# EAGLE design 17323^1 (EAGLE 7.6.0)
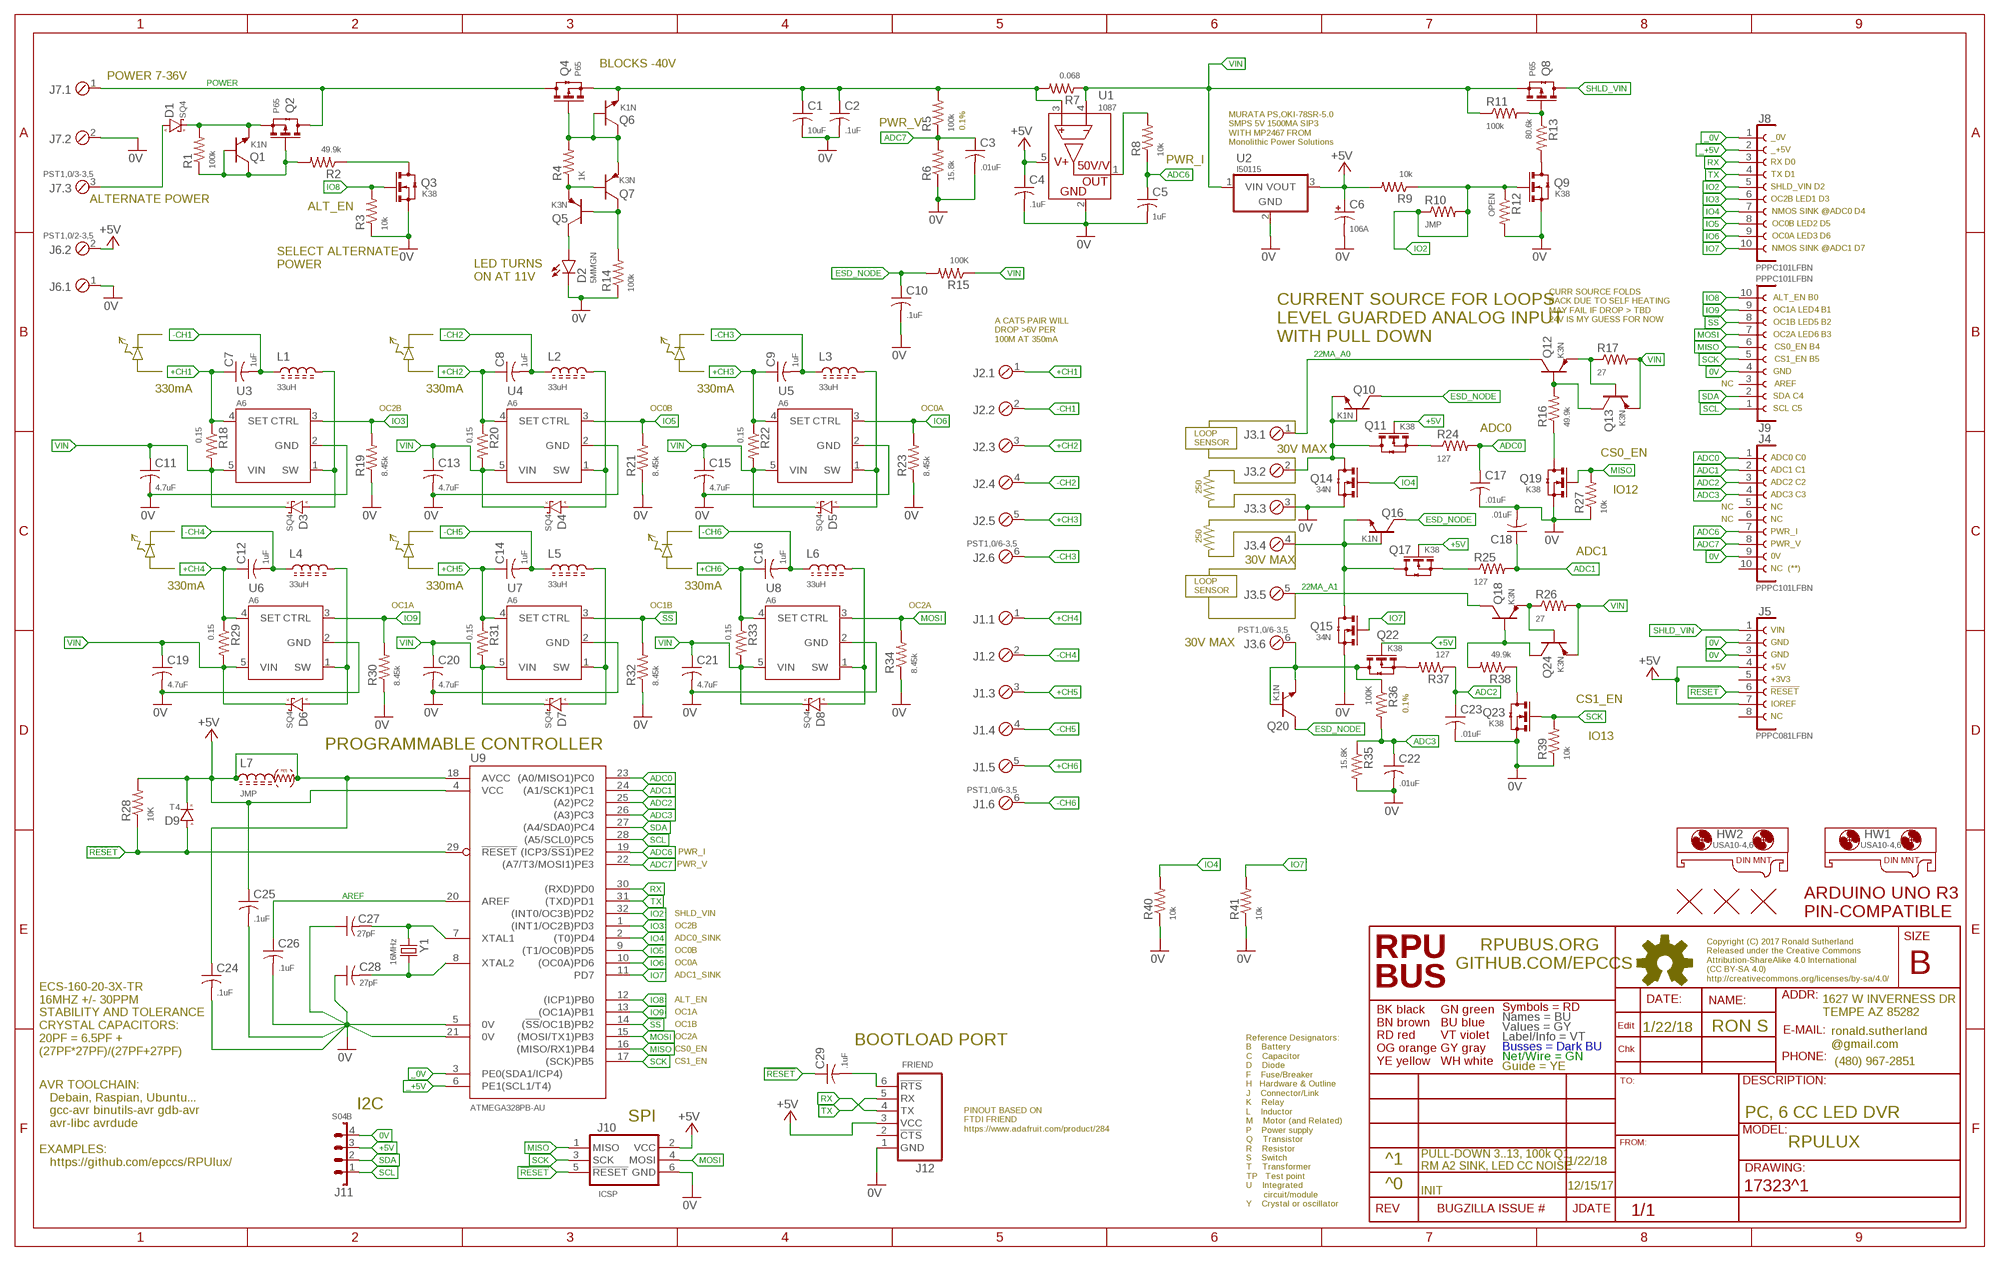
[diagram p0: schematic, sheet 1]

## Parts
C1  10uF  CC1206  [C1206(3216)]
C2  .1uF  CC0805A  [C0805(2012)]
C3  .01uF  CC0603A  [C0603(1608)]
C4  .1uF  CC0603A  [C0603(1608)]
C5  1uF  CC0805A  [C0805(2012)]
C6  106A  CT1206  [3216]
C7  1uF  CC0805A  [C0805(2012)]
C8  1uF  CC0805A  [C0805(2012)]
C9  1uF  CC0805A  [C0805(2012)]
C10  .1uF  CC0603A  [C0603(1608)]
C11  4.7uF  CC1206  [C1206(3216)]
C12  1uF  CC0805A  [C0805(2012)]
C13  4.7uF  CC1206  [C1206(3216)]
C14  1uF  CC0805A  [C0805(2012)]
C15  4.7uF  CC1206  [C1206(3216)]
C16  1uF  CC0805A  [C0805(2012)]
C17  .01uF  CC0603A  [C0603(1608)]
C18  .01uF  CC0603A  [C0603(1608)]
C19  4.7uF  CC1206  [C1206(3216)]
C20  4.7uF  CC1206  [C1206(3216)]
C21  4.7uF  CC1206  [C1206(3216)]
C22  .01uF  CC0603A  [C0603(1608)]
C23  .01uF  CC0603A  [C0603(1608)]
C24  .1uF  CC0603A  [C0603(1608)]
C25  .1uF  CC0603A  [C0603(1608)]
C26  .1uF  CC0603A  [C0603(1608)]
C27  27pF  CC0603A  [C0603(1608)]
C28  27pF  CC0603A  [C0603(1608)]
C29  .1uF  CC0603A  [C0603(1608)]
D1  SQ4  DSMA  [SMA]
D2  5MMGN  LED5MM  [LED5MM]
D3  SQ4  DSMA  [SMA]
D4  SQ4  DSMA  [SMA]
D5  SQ4  DSMA  [SMA]
D6  SQ4  DSMA  [SMA]
D7  SQ4  DSMA  [SMA]
D8  SQ4  DSMA  [SMA]
D9  T4  DSOD123  [SOD123]
HW1  USA10-4,6  MOUNT-HOLE5.0  [USA10]
HW2  USA10-4,6  MOUNT-HOLE5.0  [USA10]
J1  PST1,0/6-3,5  MCV6  [MCV6]
J2  PST1,0/6-3,5  MCV6  [MCV6]
J3  PST1,0/6-3,5  MCV6  [MCV6]
J4  PPPC101LFBN  F1X10  [F1X10]
J5  PPPC081LFBN  F1X8  [F1X8]
J6  PST1,0/2-3,5  MCV2  [MCV2]
J7  PST1,0/3-3,5  MCV3  [MCV3]
J8  PPPC101LFBN  F1X10  [F1X10]
J9  PPPC101LFBN  F1X10  [F1X10]
J10  ICSP  ISP-SPIPTH  [ISP]
J11  S04B  B04B  [B04B]
J12  FRIEND  [FRIEND]
L1  33uH  L2424  [L2424]
L2  33uH  L2424  [L2424]
L3  33uH  L2424  [L2424]
L4  33uH  L2424  [L2424]
L5  33uH  L2424  [L2424]
L6  33uH  L2424  [L2424]
L7  JMP  L0805  [C0805(2012)]
Q1  K1N  NPNSOT23  [SOT23]
Q2  P65  N-CHSOT23  [SOT23]
Q3  K38  N-CHSOT23  [SOT23]
Q4  P65  N-CHSOT23  [SOT23]
Q5  K3N  PNPSOT23  [SOT23]
Q6  K1N  NPNSOT23  [SOT23]
Q7  K3N  PNPSOT23  [SOT23]
Q8  P65  N-CHSOT23  [SOT23]
Q9  K38  N-CHSOT23  [SOT23]
Q10  K1N  NPNSOT23  [SOT23]
Q11  K38  N-CHSOT23  [SOT23]
Q12  K3N  PNPSOT23  [SOT23]
Q13  K3N  PNPSOT23  [SOT23]
Q14  34N  N-CHSOT23  [SOT23]
Q15  34N  N-CHSOT23  [SOT23]
Q16  K1N  NPNSOT23  [SOT23]
Q17  K38  N-CHSOT23  [SOT23]
Q18  K3N  PNPSOT23  [SOT23]
Q19  K38  N-CHSOT23  [SOT23]
Q20  K1N  NPNSOT23  [SOT23]
Q22  K38  N-CHSOT23  [SOT23]
Q23  K38  N-CHSOT23  [SOT23]
Q24  K3N  PNPSOT23  [SOT23]
R1  100k  R0805  [C0805(2012)]
R2  49.9k  R0805  [C0805(2012)]
R3  10k  R0805  [C0805(2012)]
R4  1K  R0805  [C0805(2012)]
R5  100k  R0805  [C0805(2012)]
R6  15.8k  R0805  [C0805(2012)]
R7  0.068  R1210  [C1210(3225)]
R8  10k  R0805  [C0805(2012)]
R9  10k  R0805  [C0805(2012)]
R10  JMP  R0805  [C0805(2012)]
R11  100k  R0805  [C0805(2012)]
R12  OPEN  R0805  [C0805(2012)]
R13  80.6k  R0805  [C0805(2012)]
R14  100k  R0805  [C0805(2012)]
R15  100K  R0805  [C0805(2012)]
R16  49.9k  R0805  [C0805(2012)]
R17  27  R0805  [C0805(2012)]
R18  0.15  R1210  [C1210(3225)]
R19  8.45k  R0805  [C0805(2012)]
R20  0.15  R1210  [C1210(3225)]
R21  8.45k  R0805  [C0805(2012)]
R22  0.15  R1210  [C1210(3225)]
R23  8.45k  R0805  [C0805(2012)]
R24  127  R0805  [C0805(2012)]
R25  127  R0805  [C0805(2012)]
R26  27  R0805  [C0805(2012)]
R27  10k  R0805  [C0805(2012)]
R28  10K  R0805  [C0805(2012)]
R29  0.15  R1210  [C1210(3225)]
R30  8.45k  R0805  [C0805(2012)]
R31  0.15  R1210  [C1210(3225)]
R32  8.45k  R0805  [C0805(2012)]
R33  0.15  R1210  [C1210(3225)]
R34  8.45k  R0805  [C0805(2012)]
R35  15.8K  R0805  [C0805(2012)]
R36  100K  R0805  [C0805(2012)]
R37  127  R0805  [C0805(2012)]
R38  49.9k  R0805  [C0805(2012)]
R39  10k  R0805  [C0805(2012)]
R40  10k  R0805  [C0805(2012)]
R41  10k  R0805  [C0805(2012)]
U1  1087  ZXCT1087  [SOT23-5]
U2  I50115  OKI-78SR-H  [OKI-78SR-H]
U3  A6  AL8805  [SOT23-5]
U4  A6  AL8805  [SOT23-5]
U5  A6  AL8805  [SOT23-5]
U6  A6  AL8805  [SOT23-5]
U7  A6  AL8805  [SOT23-5]
U8  A6  AL8805  [SOT23-5]
U9  ATMEGA328PB-AU  [TQFP32-08]
U$1  ARDUINO-UNO  [ARDUINO_UNO]
U$2  FIDUCIAL1.27  [FIDUCIAL-1.27]
U$3  FIDUCIAL1.27  [FIDUCIAL-1.27]
U$4  FIDUCIAL1.27  [FIDUCIAL-1.27]
Y1  16MHz  CSM-3X  [CSM-3X]

## Nets
0V: C1.2 C2.2 C3.2 C4.2 C5.2 C6.- C10.2 C11.2 C13.2 C15.2 C17.2 C18.2 C19.2 C20.2 C21.2 C22.2 C23.2 C24.2 C25.2 C26.2 C27.1 C28.1 D2.K J3.3 J4.9 J5.2 J5.3 J6.1 J7.2 J9.4 J10.6(GND) J11.4 J12.1(GND) Q3.2(S)(S) Q9.2(S)(S) Q14.2(S)(S) Q15.2(S)(S) Q19.2(S)(S) Q23.2(S)(S) R3.1 R6.1 R12.2 R14.1 R19.1 R21.1 R23.1 R27.1 R30.1 R32.1 R34.1 R35.2 R39.1 R40.1 R41.1 U1.2(GND) U2.2(GND) U3.2(GND) U4.2(GND) U5.2(GND) U6.2(GND) U7.2(GND) U8.2(GND) U9.5(0V) U9.21(0V)
22MA_A0: J3.1 Q12.C
22MA_A1: J3.5 Q18.C
!RESET!: C29.1 D9.A J5.6 J10.5(!RESET) R28.1 U9.29(!RESET)
!SS: J9.8 R32.2 U7.3(CTRL) U9.14((!SS!/OC1B)PB2)
+5V: C4.1 C6.+ C24.1 C25.1 D9.C(K) J5.4 J5.7 J6.2 J10.2(VCC) J11.3 J12.3(VCC) L7.1 L7.2 Q11.1(G)(G) Q17.1(G)(G) Q22.1(G)(G) R9.2 R28.2 U1.5(VCC) U2.3(VOUT) U9.4(VCC) U9.18(AVCC)
+CH1: C7.1 J2.1 R18.1 U3.4(SET)
+CH2: C8.1 J2.3 R20.1 U4.4(SET)
+CH3: C9.1 J2.5 R22.1 U5.4(SET)
+CH4: C12.1 J1.1 R29.1 U6.4(SET)
+CH5: C14.1 J1.3 R31.1 U7.4(SET)
+CH6: C16.1 J1.5 R33.1 U8.4(SET)
-CH1: C7.2 J2.2 L1.1
-CH2: C8.2 J2.4 L2.1
-CH3: C9.2 J2.6 L3.1
-CH4: C12.2 J1.2 L4.1
-CH5: C14.2 J1.4 L5.1
-CH6: C16.2 J1.6 L6.1
_0V: J8.1 U9.3(PE0(SDA1/ICP4))
_+5V: J8.2 U9.6(PE1(SCL1/T4))
ADC0: C17.1 J4.1 R24.2 U9.23((A0/MISO1)PC0)
ADC1: C18.1 J4.2 R25.2 U9.24((A1/SCK1)PC1)
ADC2: C23.1 J4.3 R37.1 U9.25((A2)PC2)
ADC3: C22.1 J4.4 R35.1 R36.2 U9.26((A3)PC3)
ADC6: C5.1 J4.7 R8.1 U9.19((ICP3/!SS1!)PE2)
ADC7: C3.1 J4.8 R5.1 R6.2 U9.22((A7/T3/MOSI1)PE3)
AREF: C26.1 U9.20(AREF)
ESD_NODE: C10.1 Q10.C Q16.C Q20.C R15.2
IO2: J8.5 Q9.1(G)(G) R9.1 R10.1 R10.2 R12.1 U9.32((INT0/OC3B)PD2)
IO3: J8.6 R19.2 U3.3(CTRL) U9.1((INT1/OC2B)PD3)
IO4: J8.7 Q14.1(G)(G) R40.2 U9.2((T0)PD4)
IO5: J8.8 R21.2 U4.3(CTRL) U9.9((T1/OC0B)PD5)
IO6: J8.9 R23.2 U5.3(CTRL) U9.10((OC0A)PD6)
IO7: J8.10 Q15.1(G)(G) R41.2 U9.11(PD7)
IO8: J9.10 Q3.1(G)(G) R3.2 U9.12((ICP1)PB0)
IO9: J9.9 R30.2 U6.3(CTRL) U9.13((OC1A)PB1)
MISO: J9.6 J10.1(MISO) Q19.1(G)(G) R27.2 U9.16((MISO/RX1)PB4)
MOSI: J9.7 J10.4(MOSI) R34.2 U8.3(CTRL) U9.15((MOSI/TX1)PB3)
N$1: Q22.2(S)(S) R37.2
N$2: Q8.1(G)(G) R11.2 R13.1
N$3: D3.A L1.2 U3.1(SW)
N$4: Q9.3(D)(D) R13.2
N$5: Q5.B Q7.C R14.2
N$6: Q4.1(G)(G) Q6.B Q6.C Q7.E R4.2
N$7: D2.A Q5.C
N$8: R8.2 U1.1(OUT)
N$9: J3.6 Q20.B Q20.E Q22.3(D)(D) R36.1
N$10: Q5.E Q7.B R4.1
N$11: D6.A L4.2 U6.1(SW)
N$12: J3.4 Q15.3(D)(D) Q16.B Q16.E Q17.3(D)(D)
N$13: Q17.2(S)(S) R25.1
N$14: Q11.2(S)(S) R24.1
N$15: J3.2 Q10.B Q10.E Q11.3(D)(D) Q14.3(D)(D)
N$16: D4.A L2.2 U4.1(SW)
N$17: D7.A L5.2 U7.1(SW)
N$18: D5.A L3.2 U5.1(SW)
N$19: Q23.3(D)(D) R38.1
N$20: Q12.E Q13.B R17.1
N$21: Q19.3(D)(D) R16.1
N$22: D8.A L6.2 U8.1(SW)
N$23: Q12.B Q13.C R16.2
N$24: D1.A J7.3
N$25: C29.2 J12.6(!RTS)
N$28: Q18.E Q24.B R26.1
N$29: Q18.B Q24.C R38.2
N$32: D1.K Q1.E Q2.2(S)(S) R1.2
N$33: Q1.B Q1.C Q2.1(G)(G) R1.1 R2.2
N$34: Q3.3(D)(D) R2.1
N$115: C27.2 U9.7(XTAL1) Y1.1
N$116: C28.2 U9.8(XTAL2) Y1.2
POWER: J7.1 Q2.3(D)(D) Q4.3(D)(D)
RX: J8.3 J12.4(TX) U9.30((RXD)PD0)
SCK: J9.5 J10.3(SCK) Q23.1(G)(G) R39.2 U9.17((SCK)PB5)
SCL: J9.1 J11.1 U9.28((A5/SCL0)PC5)
SDA: J9.2 J11.2 U9.27((A4/SDA0)PC4)
SHLD_VIN: J5.1 Q8.3(D)(D)
TX: J8.4 J12.5(RX) U9.31((TXD)PD1)
VIN: C11.1 C13.1 C15.1 C19.1 C20.1 C21.1 D3.K D4.K D5.K D6.K D7.K D8.K Q8.2(S)(S) Q13.E Q24.E R7.1 R11.1 R15.1 R17.2 R18.2 R20.2 R22.2 R26.2 R29.2 R31.2 R33.2 U1.4(S-) U2.1(VIN) U3.5(VIN) U4.5(VIN) U5.5(VIN) U6.5(VIN) U7.5(VIN) U8.5(VIN)
VIN_S: C1.1 C2.1 Q4.2(S)(S) Q6.E R5.2 R7.2 U1.3(S+)
Unconnected: J4.5 J4.6 J4.10 J5.5 J5.8 J9.3 J12.2(!CTS)

## Notes on the sheet
- BLOCKS -40V
- POWER 7-36V
- PWR_V
- 0.1%
- _0V
- MURATA PS,OKI-78SR-5.0
  SMPS 5V 1500MA SIP3
  WITH MP2467 FROM 
  Monolithic Power Solutions
- _+5V
- PWR_I | RX D0
- TX D1
- SHLD_VIN D2
- ALTERNATE POWER | OC2B LED1 D3
- ALT_EN
- NMOS SINK @ADC0 D4
- OC0B LED2 D5
- OC0A LED3 D6
- NMOS SINK @ADC1 D7
- SELECT ALTERNATE
  POWER
- LED TURNS 
  ON AT 11V
- ALT_EN B0
- OC1A LED4 B1
- CURR SOURCE FOLDS 
  BACK DUE TO SELF HEATING 
  MAY FAIL IF DROP > TBD 
  24V IS MY GUESS FOR NOW
- OC1B LED5 B2
- OC2A LED6 B3
- A CAT5 PAIR WILL
  DROP >6V PER 
  100M AT 350mA
- CURRENT SOURCE FOR LOOPS
  LEVEL GUARDED ANALOG INPUT 
  WITH PULL DOWN
- CS0_EN B4
- CS1_EN B5
- GND
- NC | AREF
- 330mA | 330mA | 330mA
- SDA C4
- OC2B | OC0B | OC0A | SCL C5
- ADC0
- LOOP 
  SENSOR
- 30V MAX
- CS0_EN
- ADC0 C0
- ADC1 C1
- ADC2 C2
- 250 | IO12
- ADC3 C3
- NC | NC
- NC | NC
- PWR_I
- 250
- PWR_V
- ADC1
- 0V
- 30V MAX
- NC  (**)
- 330mA | 330mA | 330mA
- LOOP 
  SENSOR
- OC1A | OC1B | OC2A
- VIN
- 30V MAX | GND
- GND
- +5V
- +3V3
- !RESET
- CS1_EN
- IOREF
- 0.1%
- NC
- IO13
- PROGRAMMABLE CONTROLLER
- PWR_I
- PWR_V
- SHLD_VIN
- OC2B
- ADC0_SINK
- OC0B
- OC0A
- ADC1_SINK
- ALT_EN
- OC1A
- OC1B
- 1/22/18 | RON S
- OC2A
- BOOTLOAD PORT
- CS0_EN
- ECS-160-20-3X-TR
  16MHZ +/- 30PPM
  STABILITY AND TOLERANCE
  CRYSTAL CAPACITORS:
  20PF = 6.5PF +
  (27PF*27PF)/(27PF+27PF)
- CS1_EN
- I2C
- SPI | PC, 6 CC LED DVR
- PINOUT BASED ON
  FTDI FRIEND
  https://www.adafruit.com/product/284
- RPULUX
- ^1 | 1/22/18
- AVR TOOLCHAIN: 
     Debain, Raspian, Ubuntu...
     gcc-avr binutils-avr gdb-avr 
     avr-libc avrdude
  
  EXAMPLES:
     https://github.com/epccs/RPUlux/
- PULL-DOWN 3..13, 100k Q1
  RM A2 SINK, LED CC NOISE
- ^0 | 12/15/17
- INIT

## Library data of the parts
C1-C5 C7-C29 = C-C:C: CAPACITOR Symbol
C6 = C-T:CT: Tantalum Electrolytic Capacitor
D1 D3-D8 = D-SBR:D: DIODE
D2 = D-LED:LED: LED 120120WH [CREE,XHGAWT-00-0000-00000HXE1] LED WHITE 6500K 150LUM-W120120
D9 = D-GP:D: DIODE
HW1 HW2 = HW-DINMnt:MOUNT-HOLE: USA10-4.6 [PhxCont,1202713] DINRAIL ADAPTER UNIVERSAL 10MM 4.6MM
J1-J3 = J-HDR3.5mm:MCV6: MCV 1,5/6-G-3,5 [PHOENIX CONTACT,1843648] CONN HEADER SHROUDED 6POS 3.5MM MCVR 1,5/6-ST-3,5 [PHOENIX CONTACT,1863194] CONN PLUG 6POS SCREW 3.5MM PST 1,0/6-3,5 [PHOENIX CONTACT,1945135] CONN HEADER STRIP PIN 6POS 3.5MM PT 1,5/6-PVH-3,5 [PHOENIX CONTACT,1984057] CONN PLUG STRIP 6POS 3.5MM Drill Size 3/64": .0469" (1.2mm)
J4 J8 J9 = J-HDR2.54mm:F1X10: FEMALE HEADER 10POS
J5 = J-HDR2.54mm:F1X8: FEMALE HEADER 8POS
J6 = J-HDR3.5mm:MCV2: MCV 1,5/ 2-G-3,5-RN [PHOENIX CONTACT,1731471] CONN HEADER SHROUDED 2POS 3.5MM MCVR 1,5/ 2-ST-3,5 [PHOENIX CONTACT,1863152] CONN PLUG 2POS SCREW 3.5MM PST 1,0/2-3,5 [PHOENIX CONTACT,1945096] CONN HEADER STRIP PIN 2POS 3.5MM PT1,5/2-PVH-3,5 [PHOENIX CONTACT,1984015] CONN PLUG STRIP 2POS 3.5MM
J7 = J-HDR3.5mm:MCV3: MCV 1,5/ 3-G-3,5-RN [PHOENIX CONTACT,1731484] CONN HEADER SHROUDED 3POS 3.5MM MCVR 1,5/ 3-ST-3,5 [PHOENIX CONTACT,1863165] CONN PLUG 3POS SCREW 3.5MM PST 1,0/3-3,5 [PHOENIX CONTACT,1945106] CONN HEADER STRIP PIN 3POS 3.5MM PT1,5&3-PVH-3,5 [PHOENIX CONTACT,1984028] CONN PLUG STRIP 3POS 3.5MM
J10 = U-AVR:ISP-SPI: AVR ISP thru SPI In-System Programming uses the target Atmel AVR’s internal SPI (Serial Peripheral Interface) to download code into the flash and EEPROM memories. It is not a debugging interface. When designing an application PCB which includes an AVR with the SPI interface, this pinout should be used. Sparkfun SKU: BOB-08508
J11 = J-HDR2mm:B04B: B04B [JST@B04B-PASK] CONN HEADER VERT THRU 4POS S04B [JST@S04B-PASK] CONN HEADER SIDE THRU 4POS
J12 = U-AVR:FRIEND: used for serial interfaces and serial bootloaders optiboot does not read the fuse but reports as they should be. It also erases chip. avrdude -c arduino -v -p atmega328p -P /dev/ttyUSB0 -b 115200 -U flash:w:BlinkLED.hex xboot use -e to erase chip, and -u to disable fuse checks since bootloaders can't see them. avrdude -c avr109 -v -p atmega1284p -P /dev/ttyUSB0 -b 115200 -e -u -U flash:w:BlinkLED.hex Arduino uses the nRTS (or nDTR) negative going edge to start the bootloader by causing a reset on the MCU.
L1-L6 = L-PWR:L: Inductor
L7 = L-FB:L: Ferrite Bead with frequency dependent resistance
Q1 Q6 Q10 Q16 Q20 = Q-NPN:NPN: BJT NPN General Purpose Amplifier
Q2 Q4 Q8 = Q-PCH:N-CH?*: ENHANCEMENT MODE MOSFET SOT23 is BSS138 pinout
Q3 Q9 Q11 Q14 Q15 Q17 Q19 Q22 Q23 = Q-NCH:N-CH?*: ENHANCEMENT MODE MOSFET SOT23 is BSS138 pinout
Q5 Q7 Q12 Q13 Q18 Q24 = Q-PNP:PNP: BJT NPN General Purpose Amplifier
R1-R41 = R-C:R: Resiistor American-style symbol
U1 = U-Linear:ZXCT1087: 1087 [DIODES,ZXCT1087E5TA] HISIDE CURRENT MONITOR SOT23-5
U2 = P-DCDC:OKI-78SR: OKI-78SR OKI-78SR-5/1.5-W36H-C 5V@1.5A Horizontal Mount OKI-78SR-5/1.5-W36-C 5V@1.5A Vert Mount OKI-78SR-3.3/1.5-W36H-C 3.3V@1.5A Horizontal Mount OKI-78SR-3.3/1.5-W36-C 3.3V@1.5A Vert Mount Murata Power Solutions 7 to 36 VDC input range need to verify pinout
U3-U8 = U-Linear:AL8805: A6 [DIODES,AL8805W5-7] CURR DRIVER SOT23-5
U9 = U-AVR:ATMEGA328PB-AU: ATmega328PB 4 Kbytes FLASH 128 bytes SRAM 256 bytes EEPROM 2 UART, 2 I2C, 2 SPI 8-channel 10 bit ADC
U$1 = J-BoardHDR:ARDUINO-UNO: Board Outline with holes and silk note the board dim layer is not defined
U$2-U$4 = H-Fiducial:FIDUCIAL: Fiducial Alignment Points Various fiducial points for machine vision alignment.
Y1 = Y-XTL:CSM: 16MHZ20 [ECS,ECS-160-20-3X-TR] CRYSTAL 16MHZ 20PF 30PPM CSM-3X

## Net classes
0 default: width 0.178 mm, drill 0.33 mm

## Board
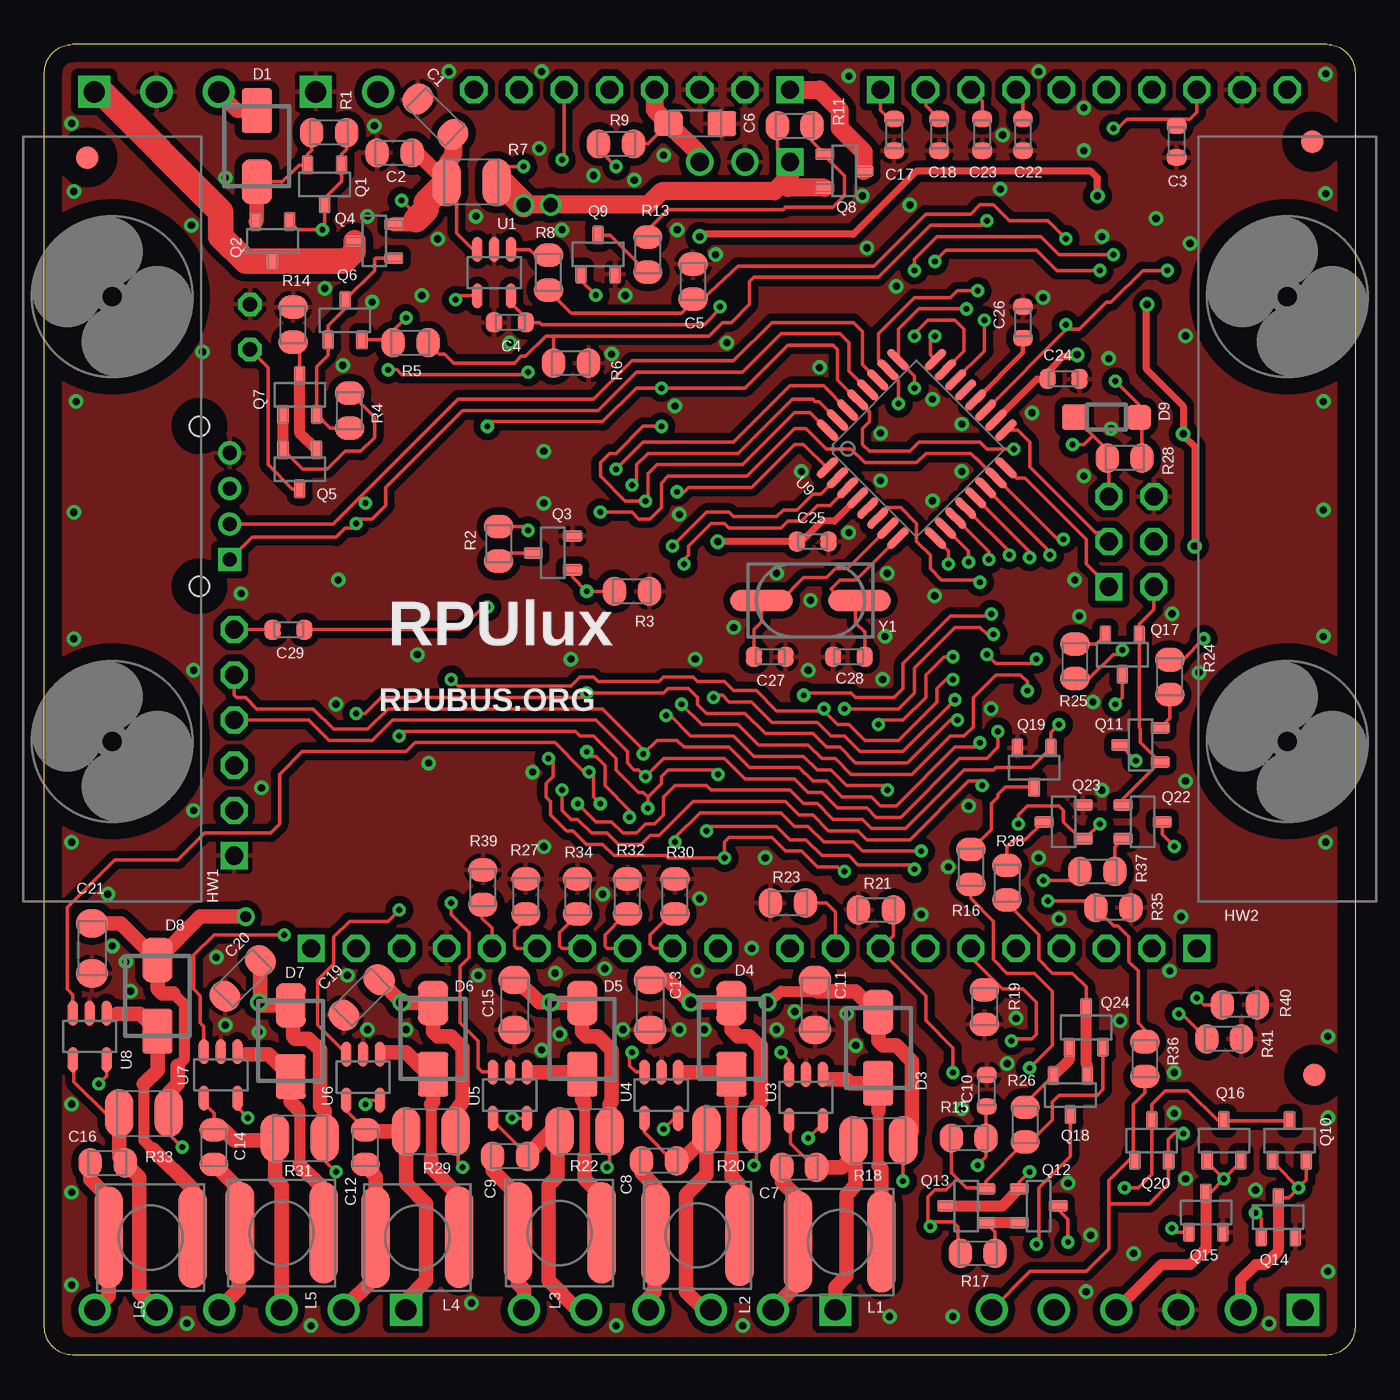
[diagram p1: board, top side]
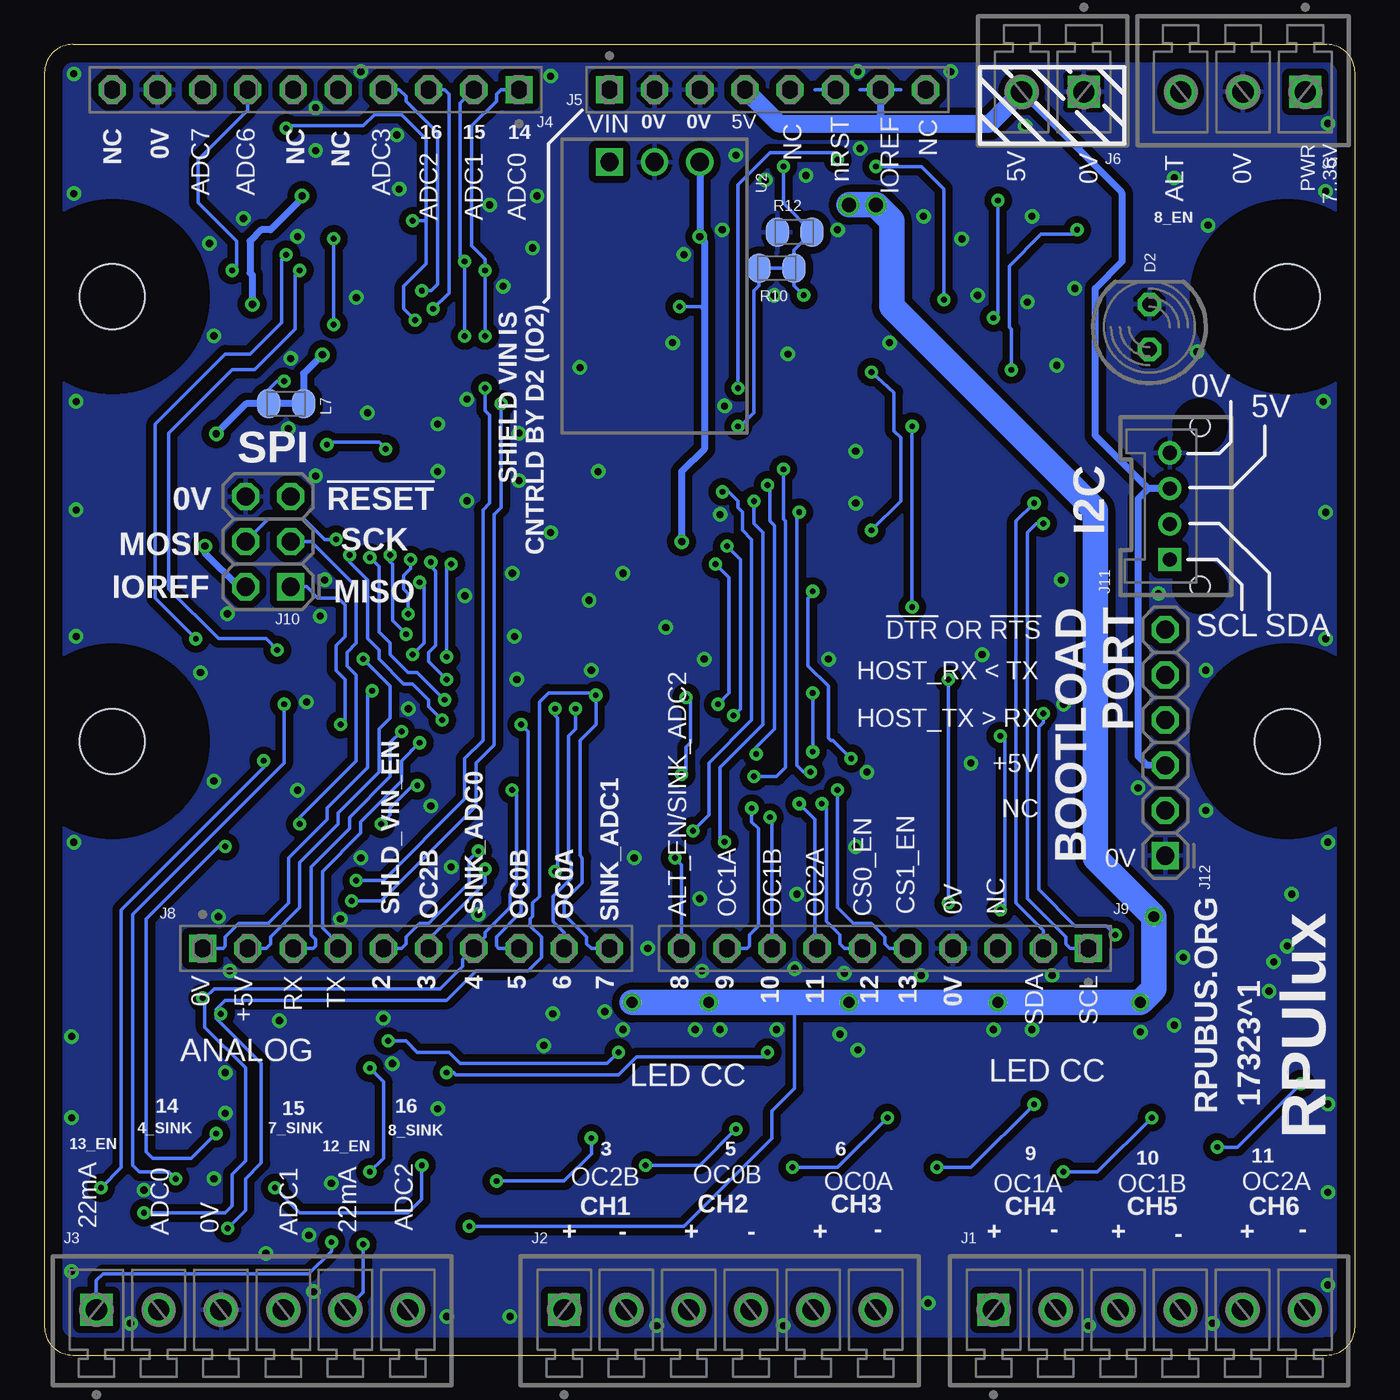
[diagram p2: board, bottom side, seen from below]

Size 73.66 x 73.66 mm. Coordinates in mm from the lower left corner, seen from the top.
Outline: 73.66,72.07 73.66,1.59 arc-90 72.07,0 1.59,0 arc-90 0,1.59 0,72.07 arc-90 1.59,73.66 72.07,73.66 arc-90 73.66,72.07
Copper layers (1*16): Top 0.034290625mm / dielectric 60mil / Bottom 0.034290625mm
Design rules "default *": minimum track width 7mil, minimum drill 13mil, track to track 12mil, track to pad 10mil, pad to pad 8mil, via to via 12mil, smd to smd 8mil, copper to edge 40mil, drill to drill 16mil, minimum pad ring 10mil, minimum via ring 8mil, stop-mask expansion 4mil, vias tented up to drill 17mil, thermal gap 10mil
tRestrict: 12 lines

### Footprints (pad centres in the part's own frame; a part is rotated, then mirrored left to right if it is on the bottom)
C1206(3216) = smd 1.6 x 1.8: 1 -1.4,0; 2 1.4,0
C0805(2012) = smd 1.321 x 1.651: 1 -0.977,0; 2 0.977,0
C0603(1608) = smd 0.898 x 1.1: 1 -0.889,0; 2 0.889,0
3216 = smd 1.6 x 1.4: + -1.5,0; - 1.5,0
SMA = smd 2.5 x 1.7: A 2,0; K -2,0
LED5MM = drill 0.813 octagon: A -1.27,0; K 1.27,0
SOD123 = smd 1.4 x 1.4: A 1.8,0; C -1.8,0
USA10 = hole 3.658: -12.5,0; 12.5,0
MCV6 = drill 1.2 square: 1 0,0 | drill 1.2: 2 3.5,0; 3 7,0; 4 10.5,0; 5 14,0; 6 17.5,0
F1X10 = drill 1.016 square: 1 0,0 | drill 1.016 octagon: 2 2.54,0; 3 5.08,0; 4 7.62,0; 5 10.16,0; 6 12.7,0; 7 15.24,0; 8 17.78,0; 9 20.32,0; 10 22.86,0
F1X8 = drill 1.016 square: 1 0,0 | drill 1.016 octagon: 2 2.54,0; 3 5.08,0; 4 7.62,0; 5 10.16,0; 6 12.7,0; 7 15.24,0; 8 17.78,0
MCV2 = drill 1.2 square: 1 0,0 | drill 1.2: 2 3.5,0
MCV3 = drill 1.2 square: 1 0,0 | drill 1.2: 2 3.5,0; 3 7,0
ISP = drill 1.016 square: 1 0,0 | drill 1.016 octagon: 2 0,2.54; 3 2.54,0; 4 2.54,2.54; 5 5.08,0; 6 5.08,2.54
B04B = drill 0.8 square: 1 0,0 | drill 0.8: 2 2,0; 3 4,0; 4 6,0 | hole 1.1: 7.5,-1.7; -1.5,-1.7
FRIEND = drill 1.016 square: 1 0,0 | drill 1.016 octagon: 2 2.54,0; 3 5.08,0; 4 7.62,0; 5 10.16,0; 6 12.7,0
L2424 = smd 1.6 x 5.7: 1 2.35,0; 2 -2.35,0
SOT23 = smd 0.65 x 1.06: B -0.95,-1.1; C 0,1.1; E 0.95,-1.1
SOT23' = smd 0.65 x 1.06: 1(G) -0.95,-1.1; 2(S) 0.95,-1.1; 3(D) 0,1.1
C1210(3225) = smd 1.6 x 2.7: 1 -1.4,0; 2 1.4,0
SOT23-5 = smd 0.55 x 1.4: 1 -0.95,-1.3; 2 0,-1.3; 3 0.95,-1.3; 4 0.95,1.3; 5 -0.95,1.3
OKI-78SR-H = drill 1.016 square: 1 0,0 | drill 1.016: 2 -2.54,0; 3 -5.08,0
TQFP32-08 = smd 1.5 x 0.45: 1 -4.293,2.8; 2 -4.293,2; 3 -4.293,1.2; 4 -4.293,0.4; 5 -4.293,-0.4; 6 -4.293,-1.2; 7 -4.293,-2; 8 -4.293,-2.8; 17 4.293,-2.8; 18 4.293,-2; 19 4.293,-1.2; 20 4.293,-0.4; 21 4.293,0.4; 22 4.293,1.2; 23 4.293,2; 24 4.293,2.8 | smd 0.45 x 1.5: 9 -2.8,-4.293; 10 -2,-4.293; 11 -1.2,-4.293; 12 -0.4,-4.293; 13 0.4,-4.293; 14 1.2,-4.293; 15 2,-4.293; 16 2.8,-4.293; 25 2.8,4.293; 26 2,4.293; 27 1.2,4.293; 28 0.4,4.293; 29 -0.4,4.293; 30 -1.2,4.293; 31 -2,4.293; 32 -2.8,4.293
FIDUCIAL-1.27 = smd 1.27 x 1.27: 1 0,0
CSM-3X = smd 3.5 x 1.2: 1 -2.75,0; 2 2.75,0

### Placement (x,y rotation side)
C1  21.97,69.6 135 top
C2  19.68,67.56 180 top
C3  63.63,68.2 270 top
C4  26.16,58.04 180 top
C5  36.45,60.33 90 top
C6  36.58,69.22 0 top
C7  42.42,10.54 180 top
C8  34.54,10.92 180 top
C9  26.16,11.18 180 top
C10  52.96,14.86 90 top
C11  43.31,19.68 270 top
C12  18.03,11.68 270 top
C13  34.04,19.68 270 top
C14  9.53,11.68 270 top
C15  26.42,19.68 270 top
C16  3.56,10.79 180 top
C17  47.75,68.58 270 top
C18  50.29,68.58 270 top
C19  17.82,20.1 225 top
C20  11.14,21.17 225 top
C21  2.67,22.86 270 top
C22  54.99,68.58 270 top
C23  52.7,68.58 270 top
C24  57.28,54.86 0 top
C25  43.18,45.72 0 top
C26  54.99,58.04 90 top
C27  40.77,39.24 180 top
C28  45.21,39.24 0 top
C29  13.72,40.77 180 top
D1  11.94,67.94 90 top
D2  11.56,57.78 90 bottom
D3  46.86,17.27 270 top
D4  38.61,17.78 270 top
D5  30.23,17.78 270 top
D6  21.84,17.78 270 top
D7  13.84,17.65 270 top
D8  6.35,20.19 270 top
D9  59.69,52.7 180 top
HW1  3.81,46.99 90 top
HW2  69.85,46.99 90 top
J1  20.32,2.54 0 bottom
J2  44.45,2.54 0 bottom
J3  70.74,2.54 0 bottom
J4  46.99,71.12 180 bottom
J5  41.91,71.12 0 bottom
J6  15.24,70.99 180 bottom
J7  2.79,70.99 180 bottom
J8  64.77,22.86 0 bottom
J9  14.99,22.86 180 bottom
J10  59.82,43.18 90 bottom
J11  10.41,44.7 90 bottom
J12  10.67,28.07 90 bottom
L1  44.7,6.35 180 top
L2  36.7,6.73 180 top
L3  28.96,6.86 180 top
L4  20.95,6.6 180 top
L5  13.34,6.86 180 top
L6  5.97,6.6 180 top
L7  60.07,53.47 180 bottom
Q1  15.75,65.79 180 top
Q2  P65  [SOT23']  12.83,62.61 180 top
Q3  K38  [SOT23']  28.57,45.09 90 top
Q4  P65  [SOT23']  18.54,62.61 90 top
Q5  14.35,49.78 180 top
Q6  16.89,58.17 0 top
Q7  14.35,53.98 0 top
Q8  P65  [SOT23']  44.96,66.55 270 top
Q9  K38  [SOT23']  31.11,61.85 0 top
Q10  69.98,12.06 0 top
Q11  K38  [SOT23']  61.59,34.29 90 top
Q12  55.88,8.38 270 top
Q13  51.82,8.38 90 top
Q14  34N  [SOT23']  69.34,7.75 0 top
Q15  34N  [SOT23']  65.28,8 0 top
Q16  66.29,12.06 0 top
Q17  K38  [SOT23']  60.58,39.37 180 top
Q18  57.66,14.61 180 top
Q19  K38  [SOT23']  55.63,33.02 180 top
Q20  62.23,12.06 0 top
Q22  K38  [SOT23']  61.72,29.97 270 top
Q23  K38  [SOT23']  57.28,29.97 90 top
Q24  58.55,18.41 0 top
R1  16,68.71 180 top
R2  25.53,45.59 90 top
R3  33.02,42.93 180 top
R4  17.14,53.09 270 top
R5  20.57,56.9 180 top
R6  29.59,55.75 180 top
R7  24,65.91 180 top
R8  28.32,60.83 90 top
R9  32.13,68.07 0 top
R10  32.51,61.09 0 bottom
R11  42.16,69.09 0 top
R12  31.5,63.12 180 bottom
R13  33.91,61.85 270 top
R14  13.97,57.91 270 top
R15  51.94,12.19 0 top
R16  52.07,27.43 270 top
R17  52.45,5.71 180 top
R18  46.86,12.06 0 top
R19  52.83,19.56 90 top
R20  38.61,12.7 0 top
R21  46.74,25.02 0 top
R22  30.35,12.57 0 top
R23  41.78,25.4 0 top
R24  63.25,38.1 90 top
R25  57.91,38.99 270 top
R26  55.12,12.95 270 top
R27  27.05,25.78 270 top
R28  60.71,50.42 0 top
R29  21.72,12.57 0 top
R30  35.43,25.78 270 top
R31  14.35,12.19 0 top
R32  32.77,25.78 270 top
R33  5.59,13.59 0 top
R34  29.97,25.78 270 top
R35  60.07,25.15 0 top
R36  61.85,16.64 90 top
R37  59.18,27.18 0 top
R38  54.1,26.54 270 top
R39  24.64,26.29 270 top
R40  67.18,19.68 180 top
R41  66.29,17.78 180 top
U1  25.27,60.83 180 top
U2  41.91,67.06 180 bottom
U3  42.8,14.48 180 top
U4  34.67,14.61 180 top
U5  26.16,14.61 180 top
U6  17.91,15.62 180 top
U7  9.91,15.75 180 top
U8  2.54,17.91 180 top
U9  49.02,50.93 45 top
U$1  -3.81,73.66 180 bottom  (outside the outline)
U$2  71.25,68.2 0 top
U$3  2.41,67.31 0 top
U$4  71.37,15.75 0 top
Y1  43.05,42.42 0 top

### Tracks (layer width: path | path; a pad name or v marks a point on that pad's centre or on a via)
0V  (via drill 0.41)
  other vias: 72.14,13.34 51.94,30.86 59.82,56.01 56.13,59.44 29.59,39.12 57.91,43.56 28.07,28.57 22.73,72.14 27.94,72.14 48.64,64.64 64.39,62.48 1.52,3.94 49.91,53.72 53.72,65.53 59.44,62.87 37.72,61.85 45.97,65.15 45.21,71.88 35.56,63.25 49.91,48.01 51.56,49.66 46.99,51.82 58.42,67.69 58.42,70.1 55.88,72.14 72.01,72.01 72.01,65.28 71.88,53.59 71.88,47.5 71.88,40.39 72.01,28.83 61.21,5.71 72.14,17.91 59.44,31.75 34.8,67.44 30.86,66.29 33.15,66.04 47.37,43.94 38.73,40.89 43.05,42.42 47.24,40.39 45.21,46.23 41.15,43.94 42.55,49.66 24.26,64.01 1.65,65.41 1.52,69.22 8.26,63.5 8.89,56.39 1.78,53.59 1.65,47.37 1.65,40.26 8.38,38.48 8.38,30.61 1.52,28.83 58.17,41.53 63.37,41.66 58.42,49.4 59.94,52.07 55.5,52.96 11.05,42.8 31.88,56.26 46.23,62.23 47.88,60.07 42.93,38.48 47.12,37.97 35.43,53.34 43.56,55.5 40.51,27.94 36.83,25.65 72.14,4.7 68.83,1.78 63.88,24.64 58.55,3.56 47.5,2.16 8,1.78 53.21,36.32 27.43,32.77 63.25,21.59 53.85,68.58 32.64,59.56 27.81,67.82 18.41,59.18 18.54,69.09 38.35,56.9 46.99,49.15 51.56,52.32 50.04,42.67 36.58,39.12 57.02,24.51 55.88,27.94 63.5,13.59 68.07,9.27 51.56,13.84 45.09,19.18 37.08,18.29 32.13,1.65 39.24,1.65 51.05,2.16 1.52,14.1 12.06,18.16 10.16,18.54 28.96,18.03 18.16,18.29 17.02,21.34 9.65,22.35 32.51,18.29 4.83,20.45 20.32,18.29 24,2.92 27.94,17.14 28.7,21.46 31.5,21.72 39.75,22.86 41.15,18.29 54.61,18.92 49.28,24.77 16.76,55.63 21.21,59.56 35.69,47.24 16.38,36.58 20.95,39.37 50.8,27.43 12.19,31.88 54.1,16.38 63.5,15.88 29.08,63.25 21.59,33.27 16.51,43.56 28.07,50.8 28.07,47.88 10.16,66.17 18.16,64.01 22.1,62.74 58.93,36.7 64.14,32.26 64.9,38.35 62.48,63.88 64.14,57.28 26.16,56.9 15.75,59.94 60.45,18.8 57.53,9.65 58.8,6.73 35.69,18.29 3.81,22.99 4.57,22.1 24.38,21.34 45.59,17.4 42.16,19.3 31.37,25.91 36.7,21.59 3.56,25.91 1.52,9.14 14.99,1.65 64.14,9.91
  pour Bottom (isolate 0.406): 0,73.66 73.66,73.66 73.66,0 0,0
  pour Top (isolate 0.406, rank 6): 0,73.66 73.66,73.66 73.66,0 0,0
22MA_A0  (via drill 0.33)
  Top 0.203: Q12.C 56.98,8.17 57.53,7.62 v57.53,6.35
  Bottom 0.203: v57.53,6.35 57.53,5.84 58.8,4.57 70.36,4.57 70.74,4.19 J3.1
22MA_A1  (via drill 0.33)
  Top 0.203: v55.75,6.22 55.88,6.35 55.88,9.4 57.66,11.18 Q18.C
  Bottom 0.203: v55.75,6.22 55.75,3.53 J3.5
!RESET!  (via drill 0.33)
  Top 0.203: v54.48,50.93 52.96,50.93 52.58,51.31 49.15,51.31 48.64,50.8 46.35,50.8 45.97,51.18 45.97,52.07 46.35,52.45 46.35,53.03 U9.29 44.58,54.81 44.58,56.52 44.32,56.77 41.78,56.77 39.37,54.36 v34.67,54.36 33.27,54.36 31.37,52.45 25.15,52.45 v24.89,52.2 | v29.08,67.18 29.21,67.31 J5.6 | J10.5 59.82,50.46 R28.1 59.73,50.87 58.92,51.68 | 58.92,51.68 D9.A | v57.78,51.18 58.42,51.18 58.92,51.68 | v24.89,42.04 24.64,42.04 23.37,40.77 C29.1
  Bottom 0.203: v57.78,51.18 57.66,51.31 54.86,51.31 v54.48,50.93 | v34.67,54.36 34.67,65.79 32.89,67.56 29.34,67.56 v29.08,67.18 | J5.6 30.35,71.12 | v24.89,52.2 v24.89,42.04
!SS  (via drill 0.33)
  Top 0.203: U9.14 56.52,45.13 v56.52,44.96 | v51.31,35.69 50.93,35.69 48.51,33.27 45.59,33.27 44.7,34.16 43.94,34.16 43.18,34.92 40.51,34.92 39.37,36.07 37.21,36.07 36.7,36.58 36.7,36.96 36.2,37.47 35.05,37.47 34.8,37.21 v30.48,37.21 30.23,36.96 18.92,36.96 18.03,36.07 v17.53,36.07 | v32.89,30.23 32.89,30.61 31.5,32 31.5,33.15 30.99,33.66 30.73,33.66 v30.48,33.91 | v13.46,23.62 9.53,23.62 8.38,22.48 8.38,20.57 8.76,20.19 8.76,18.67 8.96,18.48 U7.3 | J9.8 31.62,22.86 31.5,22.99 31.5,23.62 32.55,24.68 R32.2
  Bottom 0.203: v56.52,44.96 56.52,44.58 55.5,43.56 55.5,40.26 54.86,39.62 54.86,39.12 53.47,37.72 52.96,37.72 52.07,36.83 52.07,36.45 v51.31,35.69 | v32.89,30.23 32.77,30.1 J9.8 | v30.48,33.91 v30.48,37.21 | v13.46,23.62 13.97,24.13 15.75,24.13 17.78,26.16 17.78,35.31 17.53,35.56 v17.53,36.07
+5V  (via drill 0.33, 0.41)
  Top 0.203: R9.2 33.93,68.07 C6.+ | R28.2 61.68,52.51 D9.C 61.49,53.45 v60.2,54.74 | J10.2 62.36,41.91 61.53,41.08 Q17.1(G) 61.53,35.24 61.59,35.18 61.59,34.44 Q11.1(G) 60.62,31.27 Q22.1(G) | U1.5 26.22,59.12 27.05,58.29 C4.1 27.81,58.04 27.94,57.91 37.08,57.91 37.97,58.8 v37.97,58.93
  Top 0.406: v59.18,65.15 59.18,66.17 58.8,66.55 49.02,66.55 45.47,62.99 36.96,62.99 v36.83,62.87 | U9.4 44.39,46.86 43.69,46.86 42.55,45.72 C25.1 v37.85,45.72 | v64.64,45.47 64.64,51.05 64.01,51.69 v64.01,51.78 64.01,53.34 61.94,55.41 61.94,59.02 v61.98,59.05 | U9.18 55.79,54.86 C24.1 56.39,55.24 57.28,56.13 57.95,56.13 v58.04,56.22
  Top 1.016: U2.3 36.83,67.46 C6.+ 34.29,70 J5.4
  Bottom 0.203: v60.2,54.74 60.58,54.74 61.05,54.27 L7.2 | 27.81,71.12 J5.7 25.53,71.12 | v37.97,58.93 36.7,58.93 36.58,58.8
  Bottom 0.406: v37.85,45.72 37.85,49.66 36.58,50.93 36.58,58.8 36.58,62.61 v36.83,62.87 U2.3 | v59.18,65.15 59.18,65.02 60.96,63.25 61.47,63.25 62.1,62.61 62.1,60.83 61.98,60.71 v61.98,59.05 | 26.8,69.22 26.67,69.34 J5.7 | J11.3 11.62,48.7 | v64.64,45.47 64.64,45.09 62.74,43.18 J10.2 | v64.01,51.78 62.32,53.47 L7.2 L7.1 59.09,55.17 v58.04,56.22 | 11.62,48.7 14.61,51.69 14.61,59.94 13.08,61.47 13.08,65.28 13.15,65.41 J6.2 | J12.3 11.68,33.15 12.19,33.66 12.19,48.13 11.62,48.7
  Bottom 1.016: J5.4 32.38,69.22 26.8,69.22 20.52,69.22 J6.2
+CH1
  Top 0.203: U3.4 41.94,13.18 41.94,11.91 43.31,10.54 C7.1
  Top 0.813: J2.1 44.45,3.81 45.09,4.45 45.09,9.02 45.59,9.53 45.59,11.94 R18.1 45.47,11.18 44.83,10.54 C7.1
+CH2
  Top 0.203: U4.4 33.72,12.51 35.31,10.92 C8.1
  Top 0.813: J2.3 37.08,2.54 36.07,3.56 36.07,9.02 37.21,10.16 R20.1 37.05,12.7 36.96,12.06 35.81,10.92 C8.1
+CH3
  Top 0.203: U5.4 25.21,13.23 25.15,13.21 27.14,11.21 C9.1
  Top 0.813: J2.5 29.97,2.54 28.32,4.19 28.32,9.53 28.83,10.03 28.83,12.45 R22.1 28.41,12.57 28.32,12.45 27.14,11.26 C9.1
+CH4
  Top 0.203: U6.4 16.96,13.74 C12.1
  Top 0.813: J1.1 20.32,3.05 21.46,4.19 21.46,8.51 20.32,9.65 R29.1 18,12.57 C12.1
+CH5
  Top 0.203: U7.4 8.96,14.16 9.53,13.59 C14.1
  Top 0.813: C14.1 10.07,12.66 10.67,12.06 12.83,12.06 R31.1 12.95,9.91 13.34,9.53 13.32,9.51 J1.3
+CH6
  Top 0.203: 4.19,14.01 R33.1 3.43,13.59 1.65,15.37 1.65,16 1.59,16.06 U8.4
  Top 0.813: J1.5 5.33,3.53 5.33,9.99 C16.1 4.19,11.14 R33.1
-CH1
  Top 0.813: J2.2 40.95,2.6 42.04,3.68 42.04,6.03 L1.1 42.35,8.83 41.44,9.74 C7.2
-CH2
  Top 0.813: J2.4 33.95,3.22 34.29,3.56 34.29,6.67 L2.1 34.35,9.46 33.57,10.25 C8.2
-CH3
  Top 0.813: J2.6 26.95,3.66 26.61,4 L3.1 26.61,8.95 25.18,10.38 C9.2
-CH4
  Top 0.813: J1.2 16.82,2.6 18.61,4.38 L4.1 18.61,10.01 C12.2
-CH5
  Top 0.813: J1.4 9.82,2.58 10.92,3.68 10.92,6.79 L5.1 10.98,9.25 C14.2
-CH6
  Top 0.813: J1.6 3.62,3.34 L6.1 3.62,8.83 2.58,9.87 C16.2
_0V  (via drill 0.33)
  Top 0.203: U9.3 44.15,47.75 43.43,47.75 42.55,46.86 41.78,46.86 41.4,46.48 38.48,46.48 38.23,46.74 37.47,46.74 36.2,45.47 36.2,44.96 35.94,44.7 v35.94,44.45 | v35.81,36.58 36.96,35.43 38.99,35.43 40.13,34.29 42.93,34.29 43.69,33.53 44.45,33.53 45.34,32.64 48.77,32.64 50.93,34.8 51.69,34.8 52.2,35.31 52.2,36.96 53.47,38.23 54.86,38.23 55.24,37.85 v55.24,37.34
  Bottom 0.203: v35.81,36.58 35.18,37.21 35.18,43.69 v35.94,44.45 | J8.1 63.63,22.86 63.5,22.99 63.5,23.5 62.74,24.26 61.09,24.26 59.94,25.4 59.94,27.94 57.78,30.1 57.78,30.73 55.5,33.02 55.5,37.08 v55.24,37.34
_+5V  (via drill 0.33)
  Top 0.203: U9.6 47.42,47.62 48.13,47.62 49.02,46.74 49.02,45.72 49.78,44.96 49.78,44.2 50.42,43.56 52.45,43.56 v52.58,43.43 | v52.96,39.37 53.47,38.86 55.5,38.86 v55.75,39.12
  Bottom 0.203: v52.58,43.43 52.32,43.18 52.32,40.01 v52.96,39.37 | v55.75,39.12 54.23,37.59 54.23,35.81 54.86,35.18 54.86,32.77 57.15,30.48 57.15,29.84 59.31,27.69 59.31,25.15 60.96,23.5 60.96,23.11 61.21,22.86 J8.2
ADC0  (via drill 0.33)
  Top 0.203: U9.23 51.69,56.42 51.69,57.66 51.18,58.17 49.66,58.17 48.9,57.4 v48.9,57.28 | v60.07,61.85 57.02,61.85 56.01,62.87 50.16,62.87 48.9,61.59 v48.9,60.96 | v65.15,40.26 63.97,39.08 R24.2 | C17.1 47.5,69.47 46.99,69.98 J4.1
  Bottom 0.203: v48.9,57.28 v48.9,60.96 48.9,61.59 49.66,62.36 49.66,69.09 48.26,70.48 48.26,70.87 48.01,71.12 J4.1 | v60.07,61.85 60.33,61.59 60.33,58.04 62.1,56.26 63.5,56.26 67.44,52.32 67.44,42.55 v65.15,40.26
ADC1  (via drill 0.33)
  Top 0.203: U9.24 49.78,56.24 49.78,57.02 v50.04,57.28 | v59.31,60.96 56.9,60.96 55.75,62.1 50.67,62.1 v50.04,61.47 | R25.2 58.71,38.01 60.07,39.37 60.33,39.37 v60.58,39.62 | J4.2 49.53,70.23 C18.1
  Bottom 0.203: v50.04,57.28 v50.04,61.47 50.29,61.72 50.29,70.36 J4.2 | v59.31,60.96 59.56,60.71 59.56,57.66 61.85,55.37 63.12,55.37 66.67,51.82 66.67,43.05 63.88,40.26 61.21,40.26 v60.58,39.62
ADC2  (via drill 0.33)
  Top 0.203: v51.82,58.8 49.15,58.8 48.01,57.66 48.01,55.98 U9.25 48.9,55.01 v48.9,54.36 | C23.1 52.7,70.48 J4.3 | v56.13,26.67 57.7,26.67 R37.1
  Bottom 0.203: v51.82,58.8 50.93,59.69 50.93,70.87 51.18,71.12 J4.3 | v48.9,54.36 48.9,53.09 48.64,52.83 48.64,47.88 49.02,47.5 49.02,34.54 50.04,33.53 50.04,31.24 54.61,26.67 v56.13,26.67
ADC3  (via drill 0.33)
  Top 0.203: v52.45,59.82 51.31,59.82 50.93,59.44 48.9,59.44 46.86,57.4 46.86,55.91 U9.26 48.01,54.77 v48.01,53.47 | C22.1 54.99,70.74 J4.4 | v56.39,25.53 58.71,25.53 R35.1 60.11,24.13 60.33,24.13 60.96,23.5 60.96,22.1 61.47,21.59 61.47,18.67 61.85,18.29 R36.2
  Bottom 0.203: v52.45,59.82 51.94,59.82 51.56,60.2 51.56,68.71 53.34,70.48 53.34,70.74 53.72,71.12 J4.4 | v48.01,53.47 48.01,47.62 48.39,47.24 48.39,34.29 49.4,33.27 49.4,30.86 54.74,25.53 v56.39,25.53
ADC6  (via drill 0.33)
  Top 0.203: U9.19 57.45,57.66 | 57.45,57.66 58.17,57.66 59.69,59.18 59.94,59.18 61.72,60.96 v63.12,60.96 | v57.4,62.74 56.39,63.75 54.23,63.75 53.34,64.64 52.58,64.64 52.07,64.14 49.53,64.14 46.61,61.21 38.99,61.21 37,59.35 C5.1 | 57.45,57.66 57.45,57.87 v57.4,57.91 | C5.1 36.45,58.93 | R8.1 28.32,59.82 29.59,58.55 35.81,58.55 36.45,59.18 C5.1
  Bottom 0.203: v63.12,60.96 62.87,61.21 62.87,62.61 65.02,64.77 65.02,67.18 62.23,69.98 J4.7 | v57.4,62.74 v57.4,57.91
ADC7  (via drill 0.33)
  Top 0.203: U9.22 52.83,56.43 v52.83,58.17 | v60.07,68.96 60.33,68.96 60.83,69.47 63.63,69.47 | 63.63,69.47 64.39,69.47 64.77,69.85 J4.8 | v52.96,63.75 52.7,63.5 49.78,63.5 46.86,60.58 39.88,60.58 39.62,60.33 39.62,59.05 38.61,58.04 38.1,58.04 37.34,57.28 28.57,57.28 | 28.57,57.28 28.19,57.28 27.05,56.13 26.8,56.13 26.42,55.75 22.99,55.75 22.48,56.26 22.19,56.26 R5.1 | R6.2 28.61,57.11 28.57,57.28 | C3.1 63.63,69.47
  Bottom 0.203: v52.83,58.17 53.47,58.8 53.47,60.07 52.2,61.34 52.2,63.75 | 52.2,63.75 52.2,68.33 53.59,69.72 55.12,69.72 55.75,69.09 59.94,69.09 v60.07,68.96 | v52.96,63.75 52.2,63.75
AREF
  Top 0.254: U9.20 54.99,56.33 C26.1
ESD_NODE  (via drill 0.33)
  Top 0.203: v60.71,9.4 61.47,9.4 62.23,10.16 Q20.C 62.23,14.1 62.99,14.86 64.26,14.86 65.91,13.21 66.29,13.21 Q16.C Q10.C | v52.45,10.67 52.92,11.14 R15.2 52.92,13.93 C10.1
  Bottom 0.203: v52.45,10.67 52.45,8.76 53.21,8 59.31,8 v60.71,9.4
IO2  (via drill 0.33)
  Top 0.203: R9.1 31.15,67.78 v32.13,66.8 | Q9.1(G) 30.16,60.39 v30.99,59.56 30.93,59.63 | U9.32 43.03,52.96 42.16,52.96 39.24,50.04 34.42,50.04 33.91,49.53 33.91,48.13 v33.78,48.01 32.64,48.01 31.24,49.4 31.24,50.16 31.75,50.67 32.13,50.67 33.66,52.2 v34.67,52.2 | v49.28,28.32 45.97,28.32 45.47,28.83 43.81,28.83 42.93,29.72 42.16,29.72 41.4,30.48 36.83,30.48 35.43,29.08 v35.43,28.83
  Bottom 0.203: v33.78,48.01 33.78,46.74 33.27,46.23 33.27,35.43 35.69,33.02 35.69,29.08 v35.43,28.83 | v32.13,66.8 32.13,64.73 R12.1 | 30.48,63.08 R12.1 | v34.67,52.2 34.54,52.2 33.78,52.96 33.78,59.82 33.49,60.11 R10.1 R10.2 | R10.2 31.54,62.1 R12.1 | R10.2 31.54,60.11 v30.99,59.56 | J8.5 53.59,22.86 53.34,23.11 53.34,23.5 52.58,24.26 52.07,24.26 49.78,26.54 49.78,27.81 v49.28,28.32
IO3  (via drill 0.33)
  Top 0.203: 43.98,49.87 42.67,51.18 42.16,51.18 39.75,48.77 36.2,48.77 35.94,48.51 v35.56,48.51 | v37.21,29.46 37.47,29.72 41.15,29.72 41.91,28.96 42.8,28.96 43.69,28.07 45.21,28.07 45.72,27.56 48.64,27.56 v48.9,27.3 | J8.6 52.07,22.35 53.34,21.08 | 53.34,21.08 53.85,20.57 54.99,20.57 55.75,19.81 55.75,18.03 55.5,17.78 54.48,17.78 v54.36,17.65 | R19.2 52.83,20.57 53.34,21.08 | U3.3 41.85,16.57 v41.4,17.02
  Top 0.254: U9.1 43.98,49.87
  Bottom 0.203: v35.56,48.51 35.18,48.51 34.67,48.01 34.67,47.62 34.42,47.37 34.42,46.35 33.91,45.85 33.91,35.69 36.32,33.27 36.32,30.35 v37.21,29.46 | v48.9,27.3 48.9,26.54 52.07,23.37 J8.6 | 54.1,17.65 v54.36,17.65 53.34,17.65 52.7,17.02 50.93,17.02 50.29,16.38 42.04,16.38 v41.4,17.02
IO4  (via drill 0.33)
  Top 0.203: U9.2 43.65,48.39 43.18,48.39 42.29,47.5 41.53,47.5 41.15,47.12 38.73,47.12 38.48,47.37 37.21,47.37 v35.31,45.47 | v34.92,35.94 35.18,35.94 36.32,34.8 38.73,34.8 39.88,33.66 42.67,33.66 43.43,32.89 44.2,32.89 45.09,32 47.12,32 v47.37,31.75 | Q14.1(G) 68.39,7.68 v68.07,8 | v64.77,20.07 65.15,19.68 R40.2
  Bottom 0.203: v47.37,31.75 47.12,31.5 47.12,26.42 47.5,25.91 47.5,25.15 48.9,23.75 48.9,23.5 J8.7 50.16,22.23 50.16,21.84 51.44,20.57 64.14,20.57 64.64,20.07 | v34.92,35.94 34.54,36.32 34.54,44.7 v35.31,45.47 | v68.07,8 63.5,8 63.12,8.38 63.12,10.16 62.36,10.92 62.36,16.13 64.64,18.41 64.64,20.07 | 64.64,20.07 v64.77,20.07
IO5  (via drill 0.33)
  Top 0.203: U9.9 50.8,45.19 v50.8,44.45 | v51.05,39.24 50.55,39.24 49.53,38.23 49.53,36.96 48.26,35.69 47.12,35.69 v46.86,35.43 | U4.3 33.24,15.9 32.89,16.26 32.89,16.89 v33.02,17.02 | v51.05,15.88 51.05,17.27 49.53,18.8 49.53,20.19 47.5,22.23 47.5,22.35 J8.8 47.71,23.58 R21.2
  Bottom 0.203: v50.8,44.45 51.05,44.2 v51.05,39.24 | v46.86,35.43 46.48,35.05 46.48,26.04 46.86,25.65 46.86,24.89 48.26,23.5 48.26,22.99 48.13,22.86 J8.8 | v33.02,17.02 33.27,16.76 40.39,16.76 41.4,15.75 50.55,15.75 50.67,15.88 v51.05,15.88
IO6  (via drill 0.33)
  Top 0.203: U9.10 51.94,45.18 v51.94,44.58 | v51.05,37.97 50.67,37.97 50.16,37.47 50.16,36.7 48.01,34.54 46.1,34.54 45.21,35.43 44.58,35.43 43.81,36.2 v43.81,36.32 43.69,36.2 41.15,36.2 40.01,37.34 38.73,37.34 38.23,37.85 36.7,37.85 36.45,38.1 34.8,38.1 34.54,37.85 31.11,37.85 30.86,38.1 30.1,38.1 29.59,37.59 23.24,37.59 v22.86,37.97 | R23.2 43.94,25.4 44.45,24.89 J8.9 | U5.3 24.61,15.9 24.38,16.13 24.38,17.65 23.37,18.67 23.37,21.84 23.88,22.35 23.88,23.75 22.86,24.77 v22.86,25.4
  Bottom 0.203: J8.9 44.45,23.75 45.09,24.38 45.09,25.78 44.07,26.8 44.07,27.69 44.2,27.81 44.2,34.8 43.81,35.18 v43.81,36.32 | v51.94,44.58 51.94,44.32 51.69,44.07 51.69,39.88 52.07,39.5 52.07,38.99 v51.05,37.97 | v22.86,25.4 v22.86,37.97
IO7  (via drill 0.33)
  Top 0.203: U9.11 53.09,45.17 v53.09,44.7 | v42.67,37.08 42.8,37.21 45.34,37.21 45.59,36.96 47.75,36.96 48.26,37.47 48.26,38.86 50.93,41.53 53.09,41.53 v53.21,41.66 | Q15.1(G) 63.58,6.9 v63.37,7.11 | v63.75,19.18 63.92,19.18 R41.2
  Bottom 0.203: v53.09,44.7 53.09,44.2 53.47,43.81 53.47,43.05 53.21,42.8 v53.21,41.66 | J8.10 42.93,22.86 43.18,23.11 43.18,23.5 44.45,24.77 44.45,25.53 43.43,26.54 43.43,27.94 43.56,28.07 43.56,34.54 42.67,35.43 v42.67,37.08 42.8,37.21 45.34,37.21 45.85,36.7 45.85,25.78 46.23,25.4 46.23,24.64 46.35,24.51 46.35,24.13 45.72,23.5 45.72,22.35 46.48,21.59 49.4,21.59 51.05,19.94 63.5,19.94 64.01,19.43 64.01,18.92 | v63.37,7.11 62.36,8.13 62.36,9.91 61.47,10.79 61.47,16.38 64.01,18.92 | 64.01,18.92 v63.75,19.18
IO8  (via drill 0.33)
  Top 0.203: v53.34,40.51 52.96,40.51 52.58,40.89 51.18,40.89 48.9,38.61 48.9,37.21 48.01,36.32 v44.96,36.32 | U9.12 54.23,45.15 v54.23,44.96 | v44.96,27.18 44.83,27.18 44.58,27.43 43.43,27.43 42.55,28.32 41.66,28.32 40.89,29.08 38.48,29.08 38.23,28.83 v38.23,27.94 35.05,27.94 34.92,28.07 32,28.07 31.37,28.7 30.48,28.7 29.72,29.46 29.34,29.46 28.45,30.35 28.45,31.11 28.19,31.37 28.19,32.13 28.57,32.51 28.57,33.27 v28.32,33.53 | Q3.1(G) 29.68,43.73 v30.48,42.93 R3.2
  Bottom 0.203: v54.23,44.96 54.23,44.58 54.1,44.45 54.1,41.27 v53.34,40.51 | J9.10 37.85,27.56 v38.23,27.94 | v44.96,36.32 44.96,35.94 44.83,35.81 44.83,27.3 v44.96,27.18 | v30.48,42.93 30.48,42.8 30.73,42.55 30.73,38.73 29.59,37.59 29.59,34.67 29.46,34.54 29.34,34.54 v28.32,33.53
IO9  (via drill 0.33)
  Top 0.203: U9.13 55.37,45.14 v55.37,44.83 | v51.18,36.83 48.26,33.91 45.85,33.91 44.96,34.8 44.2,34.8 43.43,35.56 40.89,35.56 39.75,36.7 38.48,36.7 38.1,37.08 37.72,37.08 v37.59,36.96 | v37.85,32.64 37.59,32.89 35.05,32.89 34.67,32.51 34.67,32.13 33.91,31.37 | 33.91,31.37 v33.91,30.73 | v19.94,34.8 20.19,35.05 29.84,35.05 30.1,34.8 30.86,34.8 32.13,33.53 32.13,32.89 33.4,31.62 33.66,31.62 33.91,31.37 | v19.94,25.02 19.3,24.38 17.14,24.38 16.26,23.5 16.26,21.97 15.37,21.08 15.37,18.54 16.86,17.05 U6.3 | R30.2 35.09,24.68 34.04,23.62 34.04,23.11 34.29,22.86 J9.9
  Bottom 0.203: v55.37,44.83 54.86,44.32 54.86,40.64 54.23,40.01 54.23,39.37 53.21,38.35 52.7,38.35 v51.18,36.83 | J9.9 34.16,22.86 34.04,22.99 34.04,23.62 33.53,24.13 33.53,29.59 33.91,29.97 v33.91,30.73 | v37.59,36.96 37.34,36.7 37.34,34.42 37.59,34.16 37.59,32.89 v37.85,32.64 | v19.94,25.02 19.68,25.27 19.68,34.54 v19.94,34.8
MISO  (via drill 0.33)
  Top 0.203: U9.16 54.63,49.28 55.12,49.28 58.55,45.85 58.55,44.45 J10.1 | v57.02,35.43 56.58,34.99 Q19.1(G) 55.48,33.02 53.47,33.02 53.34,32.89 51.69,32.89 48.39,29.59 46.48,29.59 45.97,30.1 44.32,30.1 43.43,30.99 42.67,30.99 41.91,31.75 37.47,31.75 37.21,32 35.43,32 34.8,31.37 34.8,30.35 34.29,29.84 33.78,29.84 33.27,29.34 32.51,29.34 31.88,29.97 30.99,29.97 v29.97,30.99 | J9.6 26.54,22.86 26.42,22.99 26.42,23.88 27.05,24.51 R27.2
  Bottom 0.203: J9.6 28.7,22.86 28.96,23.11 28.96,23.62 29.72,24.38 29.72,30.73 v29.97,30.99 | J10.1 58.93,43.18 58.29,42.55 57.15,42.55 56.77,42.16 56.77,40.39 57.28,39.88 57.28,38.48 56.77,37.97 56.77,35.69 v57.02,35.43
MOSI  (via drill 0.33)
  Top 0.203: v31.24,47.37 33.02,47.37 33.4,46.99 34.04,46.99 34.67,47.62 34.67,49.02 35.05,49.4 39.5,49.4 42.16,52.07 42.8,52.07 43.94,50.93 45.34,50.93 46.1,50.16 49.02,50.16 49.53,50.67 52.07,50.67 52.32,50.42 52.36,50.42 U9.15 56.9,45.88 57.24,45.88 v57.28,45.85 | v31.24,30.99 30.86,31.37 30.86,32.51 v30.61,32.77 30.48,32.89 30.23,32.89 28.7,34.42 20.83,34.42 20.32,33.91 14.48,33.91 13.21,32.64 13.21,29.84 12.7,29.34 9.02,29.34 7.49,27.81 3.94,27.81 1.27,25.15 1.27,20.57 1.59,20.25 U8.3 | J9.7 29.08,22.86 28.96,22.99 28.96,23.75 29.46,24.26 R34.2
  Bottom 0.203: v31.24,30.99 30.35,30.1 30.35,22.99 J9.7 | v31.24,47.37 31.37,47.24 31.37,33.15 30.99,32.77 v30.61,32.77 | v57.28,45.85 57.91,45.85 59.05,46.99 61.09,46.99 J10.4
N$1
  Top 0.203: R37.2 60.16,28.56 Q22.2(S)
N$2
  Top 0.203: R11.2 43.14,68.22 Q8.1(G) 43.86,67.39 44.96,66.29 44.96,65.15 44.32,64.52 41.66,64.52 41.53,64.39 35.05,64.39 33.91,63.25 R13.1
N$3
  Top 0.406: U3.1 44.04,15.52 44.07,15.49
  Top 0.61: 46.86,10.67 46.86,13.72
  Top 0.813: L1.2 47.05,10.48 46.86,10.67 | 46.86,13.72 D3.A 45.31,15.27 45.09,15.49 44.07,15.49
N$4
  Top 0.203: R13.2 33.87,60.87 31.79,62.95 Q9.3(D)
N$5
  Top 0.203: Q7.C 14.35,56.55 R14.2
  Top 0.61: Q5.B 15.28,50.88 14.35,51.82 Q7.C
N$6
  Top 0.203: R4.2 16.07,52.11 Q7.E 15.3,55.56 15.94,56.2 Q6.B 15.94,57.85 16.89,58.8 Q6.C 16.89,59.31 18.54,60.96 18.54,61.59 18.61,61.66 Q4.1(G)
N$7
  Top 0.203: Q5.C 13.93,48.68 12.57,50.04 12.57,55.5 D2.A
N$8
  Top 0.203: R8.2 27.6,61.81 27.27,62.13 U1.1
N$9  (via drill 0.33)
  Top 0.203: Q22.3(D) 62.82,29.25 v63.5,28.57 | v64.01,12.45 63.5,12.45 63.18,12.13 Q20.E 63.18,9.59 62.1,8.51 59.82,8.51 | R36.1 61.85,14.73 61.21,14.1 61.21,11.03 Q20.B 60.96,10.96 59.82,9.82 59.82,8.51 | 59.82,8.51 59.82,5.97 58.55,4.7 55.4,4.7 J3.6
  Bottom 0.203: v63.5,28.57 63.88,28.57 67.94,24.51 67.94,11.43 67.56,11.05 65.41,11.05 v64.01,12.45
N$10
  Top 0.203: R4.1 17.18,54.06 18.54,52.7 18.54,51.56 17.78,50.8 16.89,50.8 15.88,49.78 14.5,49.78 Q5.E
  Top 0.61: Q5.E Q7.B
N$11
  Top 0.406: U6.1 19.02,17.05 19.05,17.02
  Top 0.61: 21.72,14.1 21.72,11.05
  Top 0.813: 19.05,17.02 20.32,17.02 21.21,16.13 21.5,16.13 D6.A 21.84,14.22 21.72,14.1 | 21.72,11.05 21.72,10.54 23.3,8.95 L4.2
N$12  (via drill 0.33)
  Top 0.203: Q17.3(D) 60.58,36.96 v60.2,36.58 | Q16.E 67.24,10.86 v66.29,9.91 | Q16.B 65.34,10.86 v66.29,9.91 | Q15.3(D) 65.49,9.1 v66.29,9.91
  Top 0.61: Q15.3(D) 65.28,5.97 64.39,5.08 62.78,5.08 J3.4
  Bottom 0.203: v60.2,36.58 60.2,33.27 68.71,24.77 68.71,10.67 68.33,10.29 66.67,10.29 v66.29,9.91
N$13
  Top 0.203: R25.1 59.12,39.97 Q17.2(S)
N$14
  Top 0.203: R24.1 63.25,35.79 Q11.2(S)
N$15  (via drill 0.33)
  Top 0.203: Q11.3(D) 60.49,34.25 v61.34,33.4 | Q10.E 70.93,9.84 v70.48,9.4 | Q10.B 69.17,10.71 v70.48,9.4 | Q14.3(D) 69.93,8.85 v70.48,9.4
  Top 0.61: Q14.3(D) 69.34,5.84 68.58,5.08 68.07,5.08 67.24,4.25 J3.2
  Bottom 0.203: v61.34,33.4 61.34,33.02 69.34,25.02 69.34,10.54 v70.48,9.4
N$16
  Top 0.406: U4.1 35.91,15.9 35.94,15.88
  Top 0.61: 38.61,14.22 38.61,11.18
  Top 0.813: 35.94,15.88 38.51,15.88 D4.A 38.61,14.22 | 38.61,11.18 38.61,10.03 38.99,9.65 38.99,6.79 L2.2
N$17
  Top 0.406: U7.1 11.01,16.89 11.3,16.89
  Top 0.61: 14.22,13.84 14.35,13.72 14.35,10.67
  Top 0.813: 14.22,13.84 13.84,14.22 D7.A 12.61,16.89 11.3,16.89 | 14.35,10.67 15.69,9.33 L5.2
N$18
  Top 0.406: U5.1 27.27,15.9 27.3,15.88
  Top 0.61: 30.35,13.97 30.35,11.18
  Top 0.813: 27.3,15.88 30.13,15.88 D5.A 30.23,14.35 30.35,14.22 30.35,13.97 | 30.35,11.18 30.35,9.91 31.11,9.14 | 31.11,9.14 31.11,9.27 | 31.11,9.14 31.11,7.05 L3.2
N$19
  Top 0.203: R38.1 54.1,28.57 54.48,28.96 55.12,28.96 56.13,29.97 Q23.3(D)
N$20
  Top 0.203: R17.1 53.43,6.92 Q13.B
  Top 0.61: Q12.E Q13.B
N$21
  Top 0.203: 52.07,28.45 R16.1 53.21,29.55 53.21,30.99 53.59,31.37 53.59,31.5 54.02,31.92 Q19.3(D)
N$22
  Top 0.406: U8.1 4.03,19.21 4.06,19.18
  Top 0.61: 5.59,15.24 5.59,12.06 6.1,11.56
  Top 0.813: 5.59,15.24 6.35,16 D8.A 5.37,19.18 4.06,19.18 | L6.2 8.32,9.33 6.1,11.56
N$23  (via drill 0.33)
  Top 0.203: R16.2 52.07,25.65 53.34,24.38 53.34,22.23 54.1,21.46 55.63,21.46 56.64,20.45 56.64,17.4 v55.37,16.13 | 55.12,10.03 v55.37,10.29 54.78,9.7 Q12.B
  Top 0.61: Q13.C 53.83,8.38 Q12.B
  Bottom 0.203: v55.37,16.13 54.61,15.37 54.61,11.05 v55.37,10.29
N$24
  Top 0.813: D1.A 10.84,69.94 J7.3
N$25
  Top 0.203: C29.2 J12.6
N$28
  Top 0.203: R26.1 55.12,14.12 Q18.E
  Top 0.61: Q24.B 57.6,16.59 Q18.E
N$29
  Top 0.203: R38.2 54.1,25.4 55.88,23.62 55.88,22.23 56.64,21.46 57.78,21.46 58.55,20.7 Q24.C
  Top 0.61: Q18.B 58.61,16.32 58.55,16.38 Q24.C
N$32
  Top 0.203: 12.08,65.94 D1.K 13.3,65.94 13.34,65.91 14.31,66.89 Q1.E 14.8,67.5 15.03,67.73 R1.2
  Top 0.813: D1.K 11.94,63.77 Q2.2(S)
N$33  (via drill 0.33)
  Top 0.203: R2.2 26.96,46.57 v27.18,46.35 | v27.18,55.24 27.05,55.12 20.07,55.12 19.81,55.37 v19.3,55.37 | Q2.1(G) 14.24,63.25 v15.62,63.25 15.75,63.37 Q1.C 15.75,65.02 16.7,65.97 Q1.B 16.7,67.5 16.98,67.78 R1.1
  Bottom 0.203: v27.18,46.35 25.53,48.01 25.53,51.56 25.91,51.94 25.91,54.1 v27.18,55.24 | v19.3,55.37 19.3,57.66 19.43,57.78 19.43,61.21 17.65,62.99 15.88,62.99 v15.62,63.25
N$34
  Top 0.203: Q3.3(D) 26,45.09 R2.1
N$115
  Top 0.203: U9.7 45.12,44.2 44.45,44.2 43.94,43.69 42.67,43.69 41.4,42.42 Y1.1 40.3,41.19 39.88,40.77 C27.2
N$116
  Top 0.203: U9.8 45.62,43.56 44.7,43.56 44.2,43.05 44.83,42.42 Y1.2 45.59,42.21 45.59,41.15 46.1,40.64 C28.2
POWER
  Top 0.813: 16.76,61.47 16.89,61.47 | Q2.3(D) 12.62,61.51 12.57,61.47
  Top 1.27: Q4.3(D) 17.44,62.02 16.89,61.47
  Top 1.422: J7.1 3.17,70.99 9.91,64.26 9.91,62.87 11.3,61.47 12.57,61.47 16.76,61.47
RX  (via drill 0.33)
  Top 0.203: U9.30 43.77,54.48 41.91,54.48 38.73,51.31 33.66,51.31 v32.13,49.78 | v53.59,35.05 53.59,34.16 52.96,33.53 51.44,33.53 48.13,30.23 46.74,30.23 46.23,30.73 44.58,30.73 43.69,31.62 42.93,31.62 42.16,32.38 39.37,32.38 38.23,33.53 34.8,33.53 v33.78,32.51 33.4,32.89 33.15,32.89 32.77,33.27 32.77,33.91 30.99,35.69 19.56,35.69 18.41,34.54 16,34.54 14.86,35.69 J12.4
  Bottom 0.203: J8.3 58.55,22.86 58.42,22.99 58.42,23.37 58.67,23.62 58.67,27.43 56.52,29.59 56.52,30.23 54.23,32.51 54.23,34.42 v53.59,35.05 | v32.13,49.78 32.13,46.99 32,46.86 32,33.02 32.51,32.51 v33.78,32.51
SCK  (via drill 0.33)
  Top 0.203: J10.3 59.31,46.23 59.05,46.23 55.37,49.91 55.37,51.31 54.7,51.98 U9.17 | 59.12,29.66 v59.31,29.84 58.49,29.02 Q23.1(G) 58.23,29.02 57.28,29.97 57.28,30.61 57.02,30.86 55.24,30.86 54.74,30.35 v54.74,29.84 | v29.08,31.75 29.08,30.61 29.59,30.1 29.97,30.1 30.73,29.34 31.62,29.34 32.26,28.7 33.53,28.7 34.04,29.21 34.54,29.21 36.45,31.11 41.66,31.11 42.42,30.35 43.18,30.35 44.07,29.46 45.72,29.46 46.23,28.96 48.64,28.96 51.94,32.26 52.45,32.26 v52.7,32 | R39.2 24.6,24.55 25.15,24 J9.5
  Bottom 0.203: J10.3 58.67,45.72 56.13,43.18 56.13,40.01 56.64,39.5 56.64,38.73 56.13,38.23 56.13,33.4 59.31,30.23 v59.31,29.84 | v29.08,31.75 29.08,25.15 28.19,24.26 27.18,24.26 26.42,23.5 26.42,23.11 26.16,22.86 J9.5 | v52.7,32 52.96,32 54.23,30.73 54.23,30.35 v54.74,29.84
SCL  (via drill 0.33)
  Top 0.203: U9.28 45.21,55.3 45.21,56.9 44.7,57.4 41.4,57.4 39.24,55.24 33.27,55.24 31.11,53.09 23.5,53.09 19.18,48.77 19.18,47.75 18.41,46.99 17.78,46.99 v17.53,46.74 17.27,46.48 16.89,46.48 16.38,45.97 11.68,45.97 J11.1
  Bottom 0.203: v17.53,46.74 17.91,46.74 18.41,46.23 18.41,25.65 16.26,23.5 16.26,23.11 16,22.86 J9.1
SDA  (via drill 0.33)
  Top 0.203: 17.72,48.2 23.24,53.72 30.86,53.72 33.02,55.88 38.73,55.88 40.89,58.04 45.47,58.04 45.97,57.53 45.97,55.67 U9.27 | 17.72,48.2 16.22,46.7 J11.2 | v18.03,47.88 17.72,48.2
  Bottom 0.203: J9.2 17.53,23.88 19.05,25.4 19.05,46.86 v18.03,47.88
SHLD_VIN
  Top 1.016: Q8.3(D) 46.06,67.61 44.7,68.96 44.7,69.98 43.56,71.12 J5.1
TX  (via drill 0.33)
  Top 0.203: U9.31 43.53,53.59 43.31,53.59 43.18,53.72 42.04,53.72 38.99,50.67 33.91,50.67 33.27,50.04 33.27,49.15 v33.02,48.9 | v52.58,34.42 52.32,34.16 51.18,34.16 47.88,30.86 46.99,30.86 46.48,31.37 44.83,31.37 43.94,32.26 43.18,32.26 42.42,33.02 39.62,33.02 38.48,34.16 35.94,34.16 35.56,34.54 34.42,34.54 v33.66,33.78 33.66,34.04 31.37,36.32 19.3,36.32 18.16,35.18 16.26,35.18 15.11,36.32 11.94,36.32 11.3,36.96 10.79,36.96 10.67,37.08 J12.5
  Bottom 0.203: v33.66,33.78 33.66,34.16 32.64,35.18 32.64,46.61 32.89,46.86 32.89,48.77 v33.02,48.9 | J8.4 57.15,23.11 58.04,24 58.04,27.18 55.88,29.34 55.88,29.97 53.59,32.26 53.59,33.4 v52.58,34.42
VIN  (via drill 0.33, 0.61, 0.8)
  Top 0.203: R11.1 41.19,67.78 U2.1 | U1.4 23.34,59.53 v23.11,59.31 | R7.1 25.4,66.68 25.53,66.8 v26.92,66.8 | 51.39,5.8 R17.2 51.34,5.84 51.34,7.2 51.05,7.49 50.04,7.49 v49.78,7.24 49.66,7.37 49.66,8.89 50.04,9.27 50.67,9.27 51.31,9.91 | Q24.E 59.5,14.92 59.18,14.61 57.02,14.61 56.64,14.22 56.64,13.21 55.41,11.98 R26.2 52.92,9.78 Q13.E 52.85,9.4 51.82,9.4 51.31,9.91 | 50.97,12.28 R15.1 50.97,10.25 51.31,9.91 | 48.26,11.05 R18.2 48.26,10.03 v48.26,9.78 | v39.88,10.67 40.01,10.79 R20.2 | v31.62,10.54 31.75,10.67 R22.2 | v23.5,10.54 23.24,10.79 23.24,12.45 R29.2 | v16.38,10.29 15.75,10.92 R31.2 | v7.75,11.68 6.99,12.44 R33.2 | U3.5 43.75,13.02 v42.93,12.19 | U4.5 35.4,13.3 v34.8,12.7 | U5.5 26.32,13.3 v26.29,13.34 | U6.5 18.26,14.32 v18.03,14.1 | U7.5 10.86,13.91 v11.43,13.34 | U8.5 3.49,15.68 v3.05,15.24
  Top 0.61: v40.64,19.81 41.4,20.45 43.18,20.45 C11.1 | 7.49,16.26 7.87,16.64 7.87,19.68 7.24,20.32
  Top 0.813: R18.2 48.77,12.57 48.77,16.51 47.88,17.4 47.12,17.4 46.86,17.65 D3.K 46.86,19.3 46.74,19.3 45.59,20.45 43.44,20.45 C11.1 | C13.1 35.05,21.09 v36.32,19.81 38.58,19.81 D4.K 38.61,18.29 38.99,17.91 39.62,17.91 40.16,17.37 40.26,17.37 40.26,14.22 40.01,13.97 R20.2 | R22.2 31.75,14.1 31.88,14.22 31.88,17.14 31.11,17.91 30.48,17.91 30.23,18.16 D5.K 28.61,19.78 v28.45,19.81 27.81,19.81 26.54,21.09 C15.1 | R29.2 23.12,13.72 23.5,14.22 23.5,17.27 22.86,17.91 22.1,17.91 21.84,18.16 D6.K 20.1,19.78 v20.07,19.81 18.81,21.07 C19.1 | R33.2 6.99,14.73 7.49,15.24 7.49,16.26 | 7.24,20.32 6.6,20.32 6.35,20.57 D8.K | C20.1 12.13,19.88 v12.06,19.81 12.22,19.65 D7.K 13.97,19.53 13.97,17.91 14.1,17.78 14.86,17.78 15.49,17.14 15.49,13.97 15.75,13.71 R31.2 | C21.1 4.28,24.26 D8.K | v11.3,24.64 8.76,24.64 6.35,22.23 D8.K
  Top 1.016: U2.1 41.91,66.29 41.78,66.17 | 41.78,66.17 41.02,65.41 34.67,65.41 33.91,64.64 v26.92,64.64 | Q8.2(S) 41.78,65.6 41.78,66.17
  Top 1.422: R7.1 25.4,66.16 v26.92,64.64
  Bottom 0.203: v23.11,59.31 23.11,65.53 24.38,66.8 v26.92,66.8 | v48.26,9.78 44.45,9.78 42.93,11.3 v42.93,12.19 | v26.29,13.34 29.08,10.54 v31.62,10.54 | v18.03,14.1 21.59,10.54 v23.5,10.54 | v11.43,13.34 14.48,10.29 v16.38,10.29 | v3.05,15.24 6.6,11.68 v7.75,11.68 | v49.78,7.24 37.72,7.24 32.77,12.19 32.77,13.72 31.5,14.99 31.5,19.81 | v34.8,12.7 36.83,10.67 v39.88,10.67
  Bottom 1.422: v40.64,19.81 v36.32,19.81 31.5,19.81 v28.45,19.81 v20.07,19.81 v12.06,19.81 11.3,20.57 v11.3,24.64 14.61,27.94 14.61,47.5 26.04,58.93 26.04,63.75 v26.92,64.64 v28.45,64.64
VIN_S  (via drill 0.33)
  Top 0.203: U1.3 24.1,62.13 23.17,63.06 23.17,65.6 R7.2 | Q6.E 19.43,57.07 R5.2 19.6,57.57 v20.32,58.29 | v20.07,64.9 20.89,64.07 20.89,63.82
  Top 0.813: Q4.2(S) 20.64,63.56 20.89,63.82 | C2.1 20.95,67.56 R7.2
  Top 1.016: C1.1 22.96,67.41 22.6,66.93 R7.2
  Top 1.422: 20.89,63.82 21.46,64.39 21.46,64.77 R7.2
  Bottom 0.203: v20.32,58.29 20.07,58.55 v20.07,64.9

### Text on the board
tPlace: RPUlux | RPUBUS.ORG
bPlace: IOREF | nRST | 5V | 0V | 0V | NC | NC | VIN | ADC3 | NC | NC | ADC6 | ADC7 | 0V | NC | PWR / 7..36V | 0V | 0V | 5V | 14 | ADC0 | ADC1 | 15 | 16 | ADC2 | ALT | 8_EN | SHIELD VIN IS / CNTRLD BY D2 (IO2) | 0V | 5V | SPI | 0V | !RESET | I2C | MOSI | SCK | IOREF | SCL | BOOTLOAD / PORT | MISO | !DTR! OR !RTS! | SDA | HOST_RX < TX | HOST_TX > RX | +5V | NC | 0V | NC | 0V | CS1_EN | CS0_EN | OC2A | OC1B | OC1A | ALT_EN/SINK_ADC2 | OC0A | OC0B | SINK_ADC0 | OC2B | SHLD_VIN_EN | SINK_ADC1 | SCL | SDA | 0V | 13 | 12 | 11 | 10 | 9 | 8 | 7 | 6 | 5 | 4 | 3 | 2 | TX | RX | +5V | 0V | ANALOG | LED CC | LED CC | 17323^1 | RPUBUS.ORG | 16 | 14 | 15 | RPUlux | 8_SINK | 7_SINK | 4_SINK | 13_EN | 11 | 10 | 9 | 6 | 5 | 3 | 12_EN | OC0B | OC2B | OC2A | OC1B | OC1A | OC0A | CH6 | CH5 | CH4 | CH3 | CH2 | CH1 | - | - | - | ADC2 | 22mA | ADC1 | 0V | ADC0 | 22mA | + | - | + | + | + | - | + | - | +